# EasyEDA Pro project 电磁&运放一体板.epro

# Schematic 双电感A型
Board Name: Board1; Create Date: 2025-03-03; Page Name: P1; Project Name: 电磁&运放一体板（开发中）; Schematic Name: Schematic1; Update Date: 2025-03-07; Company: 嘉立创EDA; Page Size: A4; Version: V1.0
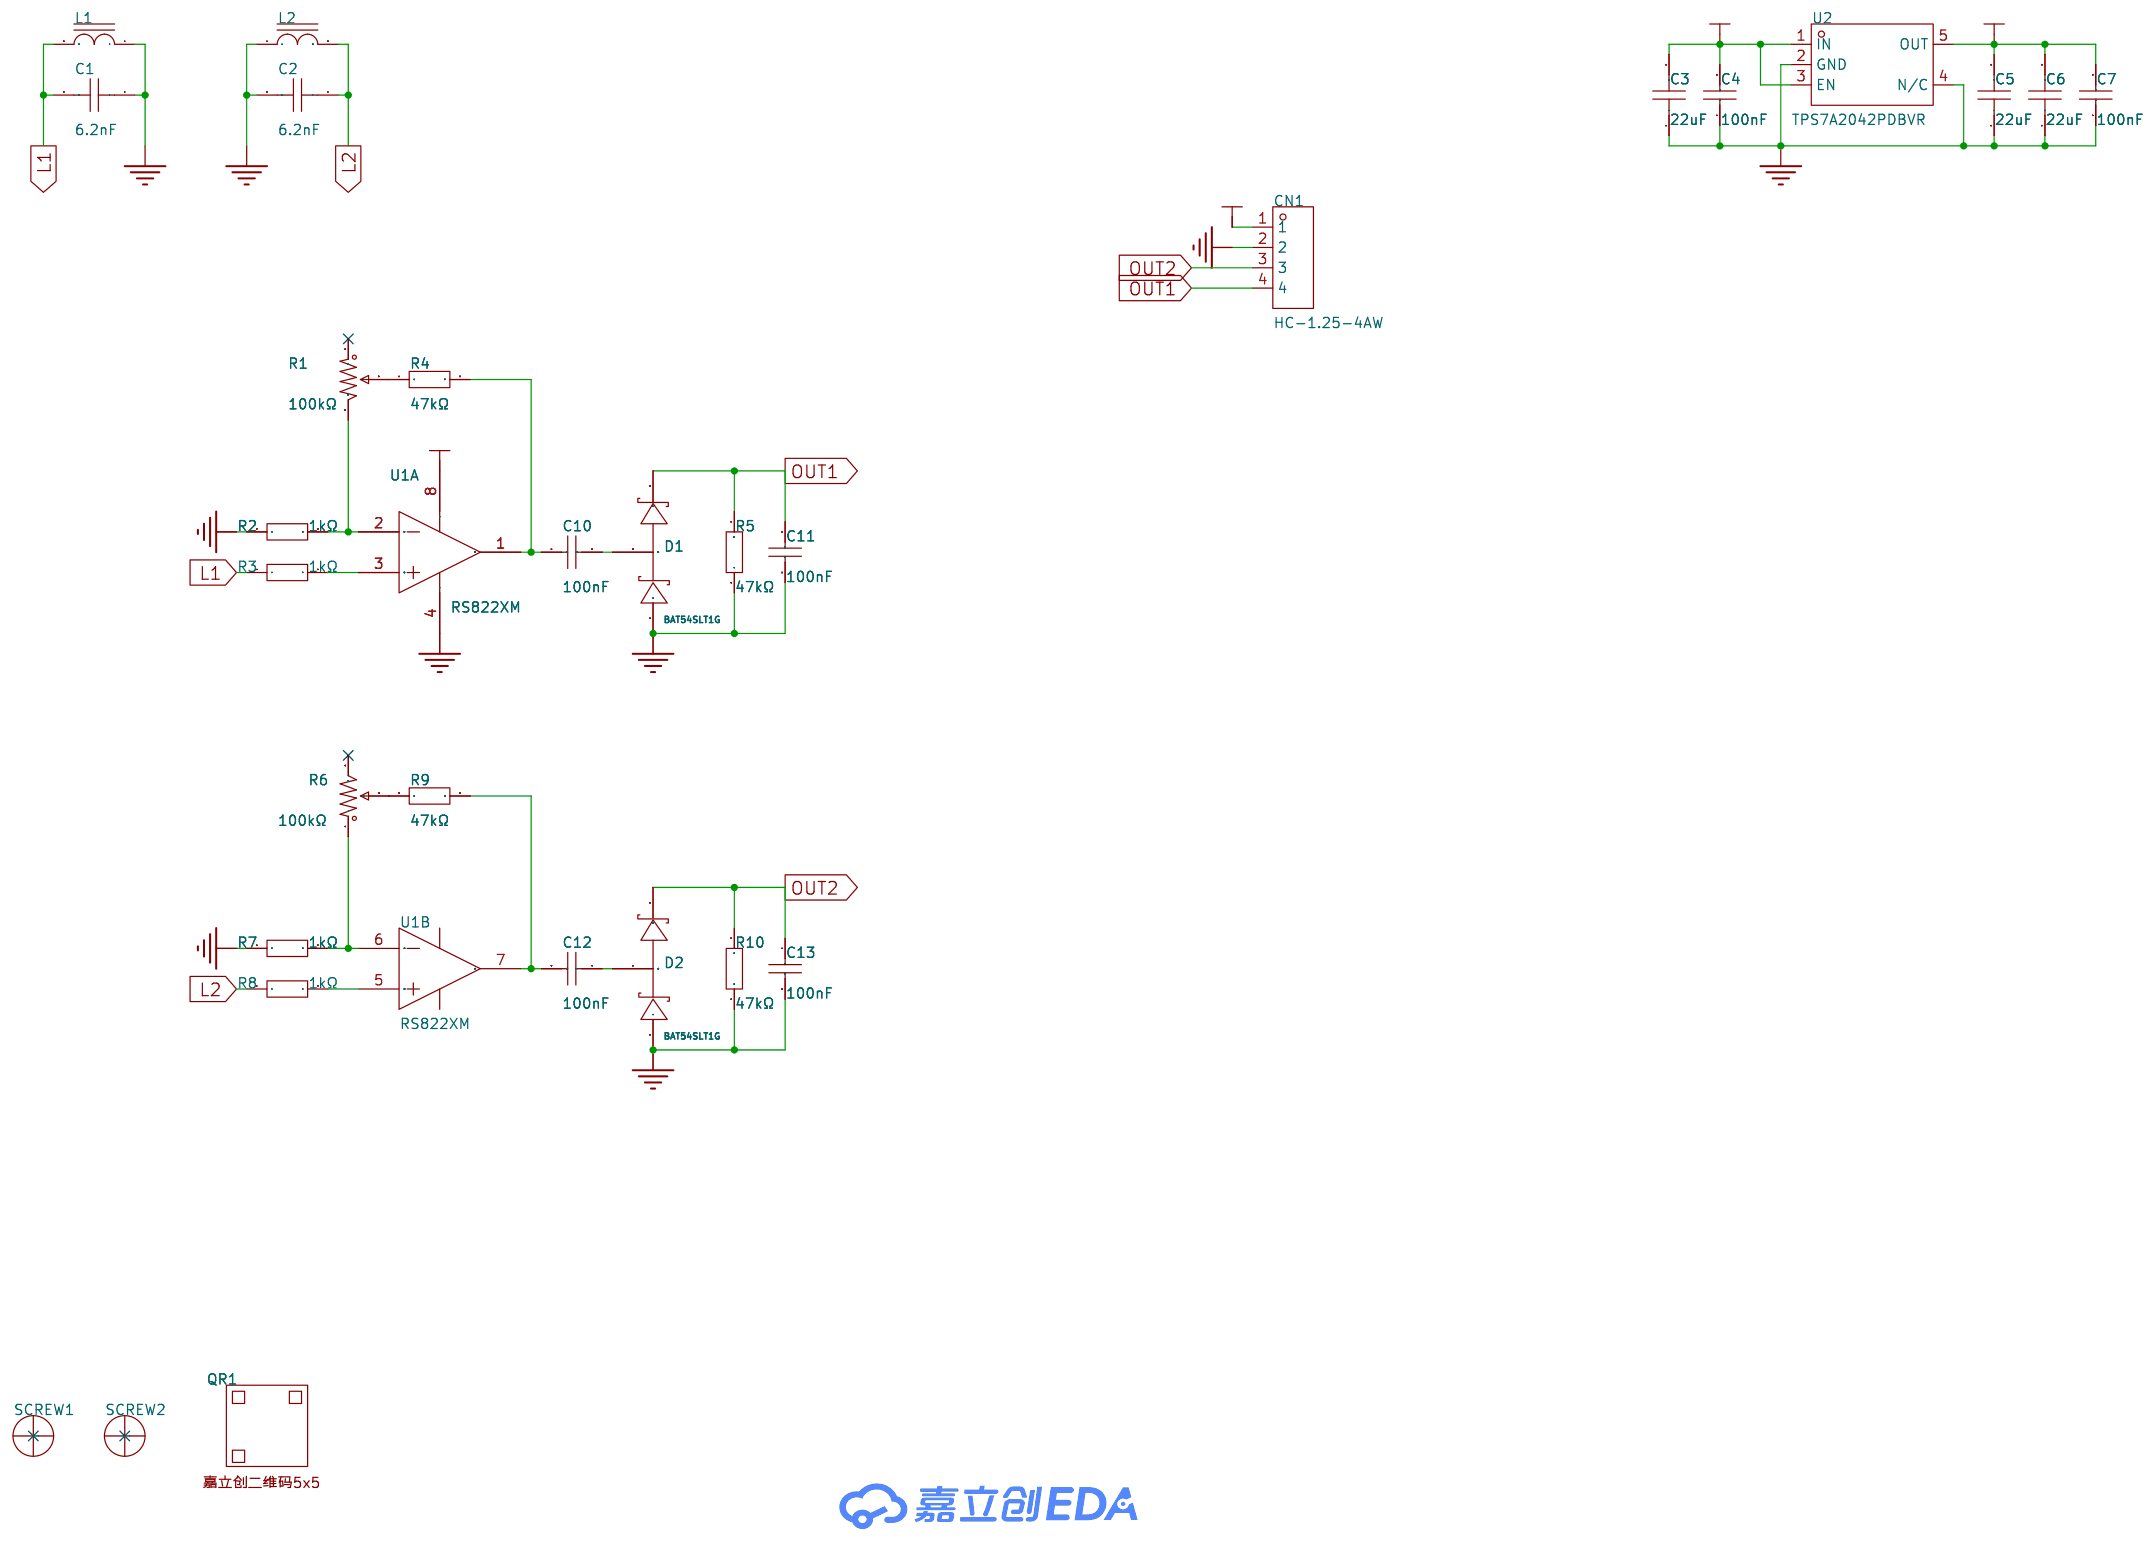
[diagram p0: schematic sheet]

## Parts
C1  6.2nF  [C0805]
C2  6.2nF  [C0805]
C3  22uF  [C0603]
C4  100nF  [C0603]
C5  22uF  [C0603]
C6  22uF  [C0603]
C7  100nF  [C0603]
C10  100nF  [C0603]
C11  100nF  [C0603]
C12  100nF  [C0603]
C13  100nF  [C0603]
CN1  HC-1.25-4AW  [CONN-TH_4P-P1.25_HCTL_HC-1.25-4AW]
D1  BAT54SLT1G  [SOT-23_L2.9-W1.3-P1.90-LS2.4-BR]
D2  BAT54SLT1G  [SOT-23_L2.9-W1.3-P1.90-LS2.4-BR]
L1  10mH  [INDUCTOR-H]
L2  10mH  [INDUCTOR-H]
QR1  -  [JLC-QRCODE-5x5]
R1  100kΩ  [RES-ADJ-SMD_TC33X-2-104E]
R2  1kΩ  [R0603]
R3  1kΩ  [R0603]
R4  47kΩ  [R0603]
R5  47kΩ  [R0603]
R6  100kΩ  [RES-ADJ-SMD_TC33X-2-104E]
R7  1kΩ  [R0603]
R8  1kΩ  [R0603]
R9  47kΩ  [R0603]
R10  47kΩ  [R0603]
SCREW1  -  [M3螺丝]
SCREW2  -  [M3螺丝]
U1  RS822XM  [MSOP-8_L3.0-W3.0-P0.65-LS5.0-BL]  (sections 1,2)
U2  TPS7A2042PDBVR  [SOT-23-5_L2.9-W1.6-P0.95-LS2.8-BR]

## Library data of the parts
C1 C2 = GRM2195C1H622JA01D: 容值:6.2nF;精度:±5%;额定电压:50V;材质(温度系数):C0G;; LCSC Part Name: 6.2nF ±5% 50V; Supplier Part: C710949; Manufacturer: muRata(村田); Supplier Footprint: 0805; JLCPCB Part Class: 扩展库; Datasheet: https://atta.szlcsc.com/upload/public/pdf/source/20230811/F8774C130DFCC406BD92840CAD6CCE22.pdf; Supplier: LCSC; Tolerance: ±5%; Voltage Rated: 50V; Temperature Coefficient: C0G
C3 C5 C6 = CL10A226MQ8NRNC: 容值:22uF;精度:±20%;额定电压:6.3V;材质(温度系数):X5R;; LCSC Part Name: 22uF ±20% 6.3V; Supplier Part: C59461; Manufacturer: SAMSUNG(三星); Supplier Footprint: 0603; JLCPCB Part Class: Basic Part; Datasheet: https://atta.szlcsc.com/upload/public/pdf/source/20160218/1457707763339.pdf; Supplier: LCSC; Tolerance: ±20%; Voltage Rated: 6.3V; Temperature Coefficient: X5R
C4 C7 C10-C13 = CC0603KRX7R9BB104: 容值:100nF;精度:±10%;额定电压:50V;材质(温度系数):X7R;; LCSC Part Name: 100nF ±10% 50V; Supplier Part: C14663; Manufacturer: YAGEO(国巨); Supplier Footprint: 0603; JLCPCB Part Class: Basic Part; Datasheet: https://atta.szlcsc.com/upload/public/pdf/source/20180910/C282072_33301C7F631E79921B82A8DAC6BCC5B3.pdf; Supplier: LCSC; Tolerance: ±10%; Voltage Rated: 50V; Temperature Coefficient: X7R
CN1 = HC-1.25-4AW: 插针结构:1x4P;间距:1.25mm;安装方式:弯插;参考系列:PicoBlade(MX 1.25);总PIN数:4P;排数:1;每排PIN数:4;行距:-;额定电流:1A;触头材质:黄铜;触头镀层:锡;工作温度范围:-25℃~+85℃;; LCSC Part Name: 1x4P 间距:1.25mm 弯插 系列:PicoBlade(MX 1.25); Supplier Part: C2845537; Manufacturer: HCTL(华灿天禄); Supplier Footprint: 弯插,P=1.25mm; JLCPCB Part Class: 扩展库; Datasheet: https://atta.szlcsc.com/upload/public/pdf/source/20230707/04F6BEA69F699E7BB6558EF06AF1DC24.pdf; Supplier: LCSC; Pins Structure: 1x4P; Pitch: 1.25mm; Mounting Style: 弯插; Reference Series: PicoBlade(MX 1.25); Number of Pins: 4P; Number of Rows: 1; Number of PINs Per Row: 4; Current Rating (Max): 1A; Contact Material: 黄铜; Contact Plating: 锡; Operating Temperature Range: -25℃~+85℃; Rated Voltage (Max): 125V; Plastic Material: PA46; Flame Retardant Rating: UL94V-0; Z-Height of the Board: 3.2mm; X-Length of Bottom Edge on Board (Spacing Line): 6.75mm; Y-Width of Bottom Edge on Board: 4.7mm
D1 D2 = BAT54SLT1G: 二极管配置:1对串联式;正向压降(Vf):800mV@100mA;直流反向耐压(Vr):30V;平均整流电流(Io):200mA;; LCSC Part Name: 电压:30V 电流:200mA; Supplier Part: C19726; Manufacturer: onsemi(安森美); Supplier Footprint: SOT-23; JLCPCB Part Class: 扩展库; Datasheet: https://atta.szlcsc.com/upload/public/pdf/source/20140815/1457707218410.pdf; Supplier: LCSC; Diode Configuration: 1对串联式; Forward Voltage (Vf@If): 800mV@100mA; Reverse Voltage (Vr): 30V; Average Rectified Current (Io): 200mA; Reverse Leakage Current (Ir): 2uA@25V
L1 L2 = 工字电感: Published: 8-Jun-2000; Revision: July-2002: Re-released for DXP Platform.; Publisher: Altium Limited; DCR: .5m; Price(RMB): 0.000; Imax: 1A; Origin Footprint 2: CD31; Origin Footprint 3: CD32; Origin Footprint 4: CD42; Origin Footprint 5: CD43; Origin Footprint 6: CD52; Origin Footprint 7: CD53; Origin Footprint 8: CD54; Origin Footprint 9: CD73; Origin Footprint 10: CD75; Origin Footprint 11: CD104; Origin Footprint 12: CD105; Origin Footprint 13: CD106; Origin Footprint 14: 127 Shielded 12.5*12.5*7; Origin Footprint 15: 0630 TPC 7*7*3; Origin Footprint 16: 1050 TPC 10*10*5; Origin Footprint 17: 1265 TPC 12*12*6.5; Origin Footprint 18: CD104R; Origin Footprint 19: SLO2520; Origin Footprint 20: 1365 TPC 13*13*6.5; Origin Footprint 21: INDUCTOR; Origin Footprint 22: 0402 TPC 4*4*2
QR1 = 嘉立创二维码5x5
R1 R6 = TC33X-2-104E: 阻值:100kΩ;精度:±25%;功率:150mW;温度系数:±250ppm/℃;; LCSC Part Name: 100kΩ ±25%; Supplier Part: C719186; Manufacturer: BOURNS; Supplier Footprint: SMD-3P,3.8x3.6mm; Datasheet: https://atta.szlcsc.com/upload/public/pdf/source/20200810/C720646_BB66A75E654D5E1D30127FF45BCD3C26.pdf; Supplier: LCSC; Tolerance: ±25%; Power(Watts): 150mW; Temperature Coefficient: ±250ppm/℃; Turns: 1
R2 R3 R7 R8 = RC0603FR-071KL: 电阻类型:厚膜电阻;阻值:1kΩ;精度:±1%;功率:100mW;最大工作电压:75V;温度系数:±100ppm/℃;; LCSC Part Name: 厚膜电阻 1kΩ ±1% 100mW; Supplier Part: C22548; Manufacturer: YAGEO(国巨); Supplier Footprint: 0603; JLCPCB Part Class: Extended Part; Datasheet: https://atta.szlcsc.com/upload/public/pdf/source/20180316/70C0E2BDAE7FCC62C531A5A58D202EE1.pdf; Supplier: LCSC; Type: 厚膜电阻; Tolerance: ±1%; Power(Watts): 100mW; Overload Voltage (Max): 75V; Temperature Coefficient: ±100ppm/℃; Operating Temperature Range: -55℃~+155℃
R4 R5 R9 R10 = RC0603FR-0747KL: 电阻类型:厚膜电阻;阻值:47kΩ;精度:±1%;功率:100mW;最大工作电压:75V;温度系数:±100ppm/℃;; LCSC Part Name: 厚膜电阻 47kΩ ±1% 100mW; Supplier Part: C105579; Manufacturer: YAGEO(国巨); Supplier Footprint: 0603; JLCPCB Part Class: Extended Part; Datasheet: https://atta.szlcsc.com/upload/public/pdf/source/20180316/70C0E2BDAE7FCC62C531A5A58D202EE1.pdf; Supplier: LCSC; Type: 厚膜电阻; Tolerance: ±1%; Power(Watts): 100mW; Overload Voltage (Max): 75V; Temperature Coefficient: ±100ppm/℃; Operating Temperature Range: -55℃~+155℃
SCREW1 SCREW2 = M3螺丝
U1 = RS822XM: 放大器数:双路;轨到轨:轨到轨输入,轨到轨输出;增益带宽积(GBP):14MHz;输入失调电压(Vos):2.5mV;压摆率(SR):10V/us;; LCSC Part Name: 低噪声运放RS822XM; Supplier Part: C255442; Manufacturer: RUNIC(润石); Supplier Footprint: MSOP-8; JLCPCB Part Class: 扩展库; Datasheet: https://atta.szlcsc.com/upload/public/pdf/source/20180801/C255445_305A33E98EF65BC5D144120E205E7EFA.pdf; Supplier: LCSC; Number of Circuits: 双路; Maximum Power Supply Range (Vdd-Vss): 5.5V; Rail to Rail: 轨到轨输入,轨到轨输出; Gain Bandwidth Product(GBP): 14MHz; Voltage - Input Offset(Vos): 2.5mV; Input Offset Voltage Drift (Vos TC): 1.6uV/℃; Slew Rate(SR): 10V/us; Noise density(eN): 5.5nV/√Hz@10kHz; Common Mode Rejection Ratio (CMRR): 75dB; Operating Temperature: -40℃~+125℃
U2 = TPS7A2042PDBVR: 输出类型:固定;最大输入电压:6V;输出电压:4.2V;输出电流:300mA;输出极性:正极;; LCSC Part Name: 具有高 PSRR 的 300mA、超低噪声、低 IQ、低压降 (LDO) 线性稳压器; Supplier Part: C2877861; Manufacturer: TI(德州仪器); Supplier Footprint: SOT-23-5; JLCPCB Part Class: 扩展库; Datasheet: https://www.ti.com/cn/lit/gpn/tps7a20; Supplier: LCSC; Output Type: 固定; Maximum Input Voltage: 6V; Output Voltage: 4.2V; Output Current: 300mA; Dropout Voltage: 145mV@(300mA); standby current: 15uA; Feature: 防静电保护；软启动；浪涌保护；低ESR；热保护(TSD)；欠压闭锁；过流保护(OCP)；带使能；防倒灌; Operating Temperature: -40℃~+125℃@(Tj); Output Polarity: 正极; Number of Outputs: 1

## Nets
4V2: C5.2 C6.2 C7.2 U1.8(V+) U2.5(OUT)
+5V: C3.2 C4.2 CN1.1 U2.1(IN) U2.3(EN)
GND: C1.1 C2.2 C3.1 C4.1 C5.1 C6.1 C7.1 C11.2 C13.2 CN1.2 D1.1(A) D2.1(A) L1.1 L2.1 R2.1 R5.1 R7.1 R10.1 U1.4(V-) U2.2(GND) U2.4(N/C)
L1: C1.2 L1.2 R3.1
L2: C2.1 L2.2 R8.1
OUT1: C11.1 CN1.4 D1.2(C) R5.2
OUT2: C13.1 CN1.3 D2.2(C) R10.2
$1N2795: R1.3 R2.2 U1.2(-INA)
$1N2799: R3.2 U1.3(+INA)
$1N2904: R1.2 R4.1
$1N2908: C10.2 R4.2 U1.1(OUTA)
$1N3029: C10.1 D1.3(A/C)
$1N3708: R6.1 R7.2 U1.6(-INB)
$1N3712: R8.2 U1.5(+INB)
$1N3714: R6.2 R9.1
$1N3716: C12.2 R9.2 U1.7(OUTB)
$1N3721: C12.1 D2.3(A/C)

Not connected (* = marked no-connect by the designer): R1 1*; R6 3*; SCREW1 1*; SCREW2 1*

# Schematic 双电感A型V2
Board Name: 双电感A型V2; Create Date: 2025-03-24; Page Name: P1; Project Name: （调试中）电磁&运放一体板; Schematic Name: 双电感A型V2; Update Date: 2025-03-25; Company: 嘉立创EDA; Page Size: A4; Version: V1.0
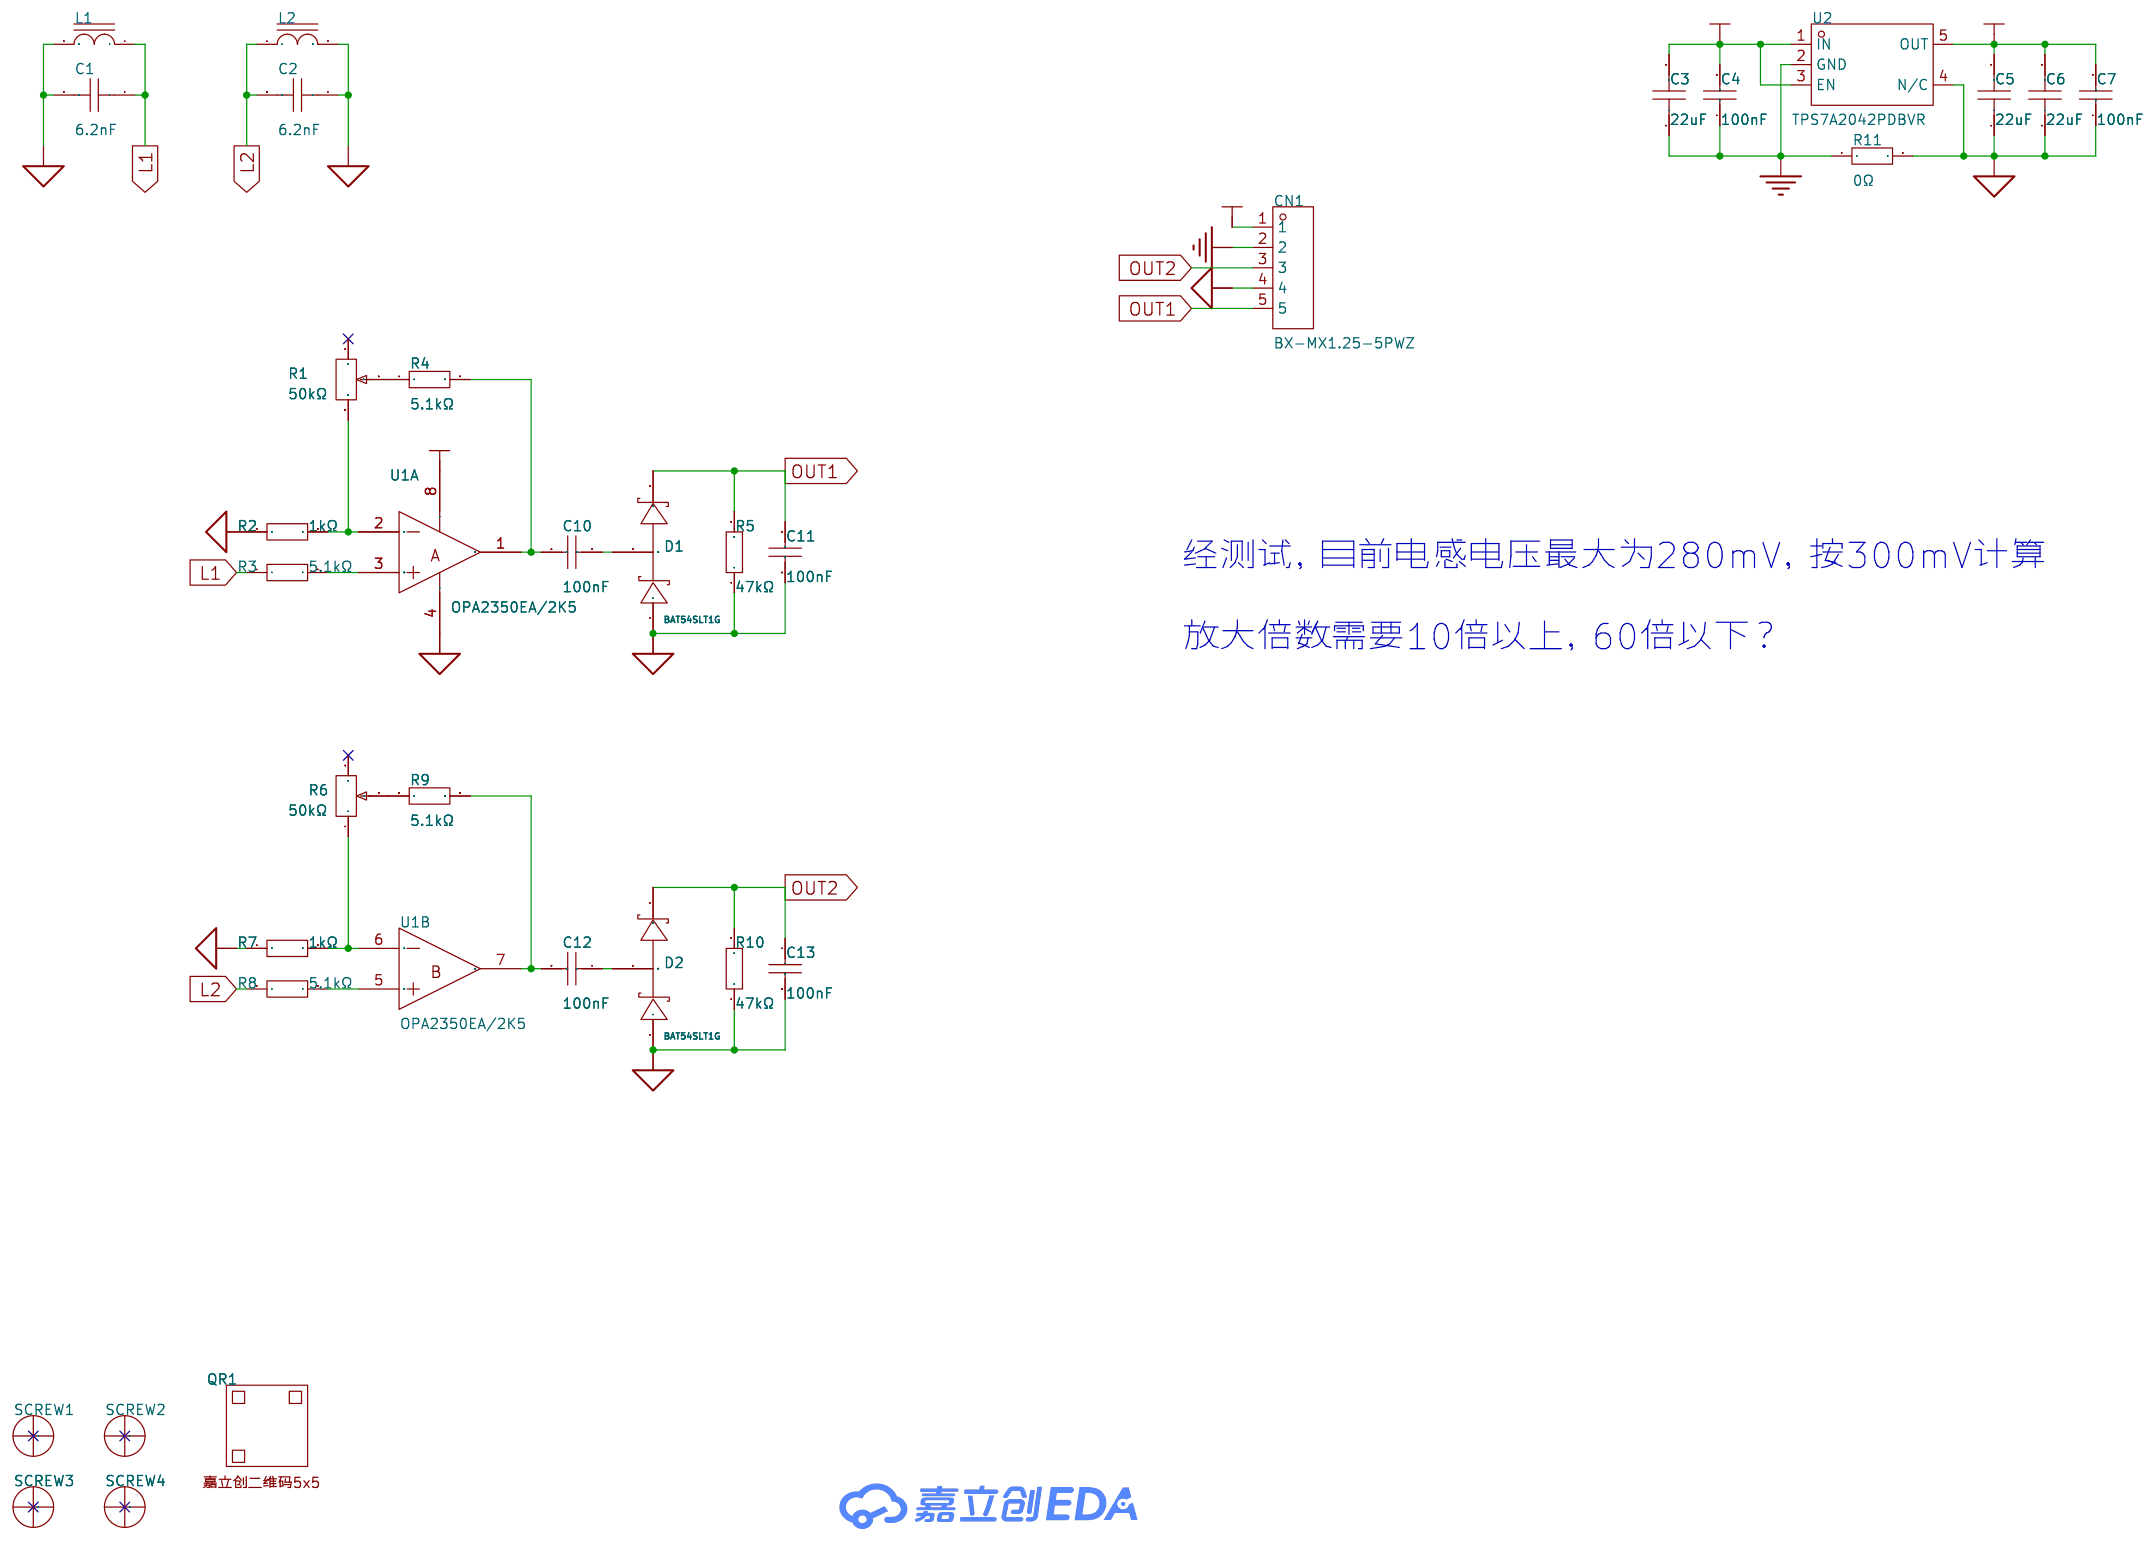
[diagram p1: schematic sheet]

## Parts
C1  6.2nF  [C0805]
C2  6.2nF  [C0805]
C3  22uF  [C0603]
C4  100nF  [C0603]
C5  22uF  [C0603]
C6  22uF  [C0603]
C7  100nF  [C0603]
C10  100nF  [C0603]
C11  100nF  [C0603]
C12  100nF  [C0603]
C13  100nF  [C0603]
CN1  BX-MX1.25-5PWZ  [CONN-TH_5P-P1.25_BX-MX1.25-5PWZ]
D1  BAT54SLT1G  [SOT-23_L2.9-W1.3-P1.90-LS2.4-BR]
D2  BAT54SLT1G  [SOT-23_L2.9-W1.3-P1.90-LS2.4-BR]
L1  10mH  [INDUCTOR-H]
L2  10mH  [INDUCTOR-H]
QR1  -  [JLC-QRCODE-5x5]
R1  50kΩ  [RES-ADJ-SMD_3224W]
R2  1kΩ  [R0603]
R3  5.1kΩ  [R0603]
R4  5.1kΩ  [R0603]
R5  47kΩ  [R0603]
R6  50kΩ  [RES-ADJ-SMD_3224W]
R7  1kΩ  [R0603]
R8  5.1kΩ  [R0603]
R9  5.1kΩ  [R0603]
R10  47kΩ  [R0603]
R11  0Ω  [R0805]
SCREW1  -  [M3螺丝]
SCREW2  -  [M3螺丝]
SCREW3  -  [M3螺丝]
SCREW4  -  [M3螺丝]
U1  OPA2350EA/2K5  [VSSOP-8_L3.0-W3.0-P0.65-LS5.0-BL]  (sections 1,2)
U2  TPS7A2042PDBVR  [SOT-23-5_L2.9-W1.6-P0.95-LS2.8-BR]

## Library data of the parts
C1 C2 = GRM2195C1H622JA01D: 容值:6.2nF;精度:±5%;额定电压:50V;材质(温度系数):C0G;; LCSC Part Name: 6.2nF ±5% 50V; Supplier Part: C710949; Manufacturer: muRata(村田); Supplier Footprint: 0805; JLCPCB Part Class: 扩展库; Datasheet: https://atta.szlcsc.com/upload/public/pdf/source/20230811/F8774C130DFCC406BD92840CAD6CCE22.pdf; Supplier: LCSC; Tolerance: ±5%; Voltage Rated: 50V; Temperature Coefficient: C0G
C3 C5 C6 = CL10A226MQ8NRNC: 容值:22uF;精度:±20%;额定电压:6.3V;材质(温度系数):X5R;; LCSC Part Name: 22uF ±20% 6.3V; Supplier Part: C59461; Manufacturer: SAMSUNG(三星); Supplier Footprint: 0603; JLCPCB Part Class: Basic Part; Datasheet: https://atta.szlcsc.com/upload/public/pdf/source/20160218/1457707763339.pdf; Supplier: LCSC; Tolerance: ±20%; Voltage Rated: 6.3V; Temperature Coefficient: X5R
C4 C7 C10-C13 = CC0603KRX7R9BB104: 容值:100nF;精度:±10%;额定电压:50V;材质(温度系数):X7R;; LCSC Part Name: 100nF ±10% 50V; Supplier Part: C14663; Manufacturer: YAGEO(国巨); Supplier Footprint: 0603; JLCPCB Part Class: Basic Part; Datasheet: https://atta.szlcsc.com/upload/public/pdf/source/20180910/C282072_33301C7F631E79921B82A8DAC6BCC5B3.pdf; Supplier: LCSC; Tolerance: ±10%; Voltage Rated: 50V; Temperature Coefficient: X7R
CN1 = BX-MX1.25-5PWZ: 插针结构:1x5P;间距:1.25mm;安装方式:弯插;参考系列:PicoBlade(MX 1.25);总PIN数:5P;排数:1;每排PIN数:5;行距:-;额定电流:1A;触头材质:黄铜;触头镀层:锡;工作温度:-25℃~+85℃;; LCSC Part Name: 1x5P 间距:1.25mm 弯插 系列:PicoBlade(MX 1.25); Supplier Part: C18077930; Manufacturer: Bossie(博锡); Supplier Footprint: 弯插,P=1.25mm; Datasheet: https://atta.szlcsc.com/upload/public/pdf/source/20231017/B7120ECF0A2D0178FB1687BFB19F48BC.pdf; Supplier: LCSC; Pins Structure: 1x5P; Pitch: 1.25mm; Mounting Type: 弯插; Reference Series: PicoBlade(MX 1.25); Number of Pins: 5P; Number of Rows: 1; Number of PINs Per Row: 5; Current Rating: 1A; Contact Material: 黄铜; Contact Plating: 锡; Operating Temperature: -25℃~+85℃; Voltage Rating: 125V; Plastic Material: PA; Color: 白色; Z-Height of the Board: 3.3mm; X-Length of Bottom Edge on Board (Spacing Line): 8.15mm; Y-Width of Bottom Edge on Board: 4.6mm
D1 D2 = BAT54SLT1G: 二极管配置:1对串联式;正向压降(Vf):800mV@100mA;直流反向耐压(Vr):30V;平均整流电流(Io):200mA;; LCSC Part Name: 电压:30V 电流:200mA; Supplier Part: C19726; Manufacturer: onsemi(安森美); Supplier Footprint: SOT-23; JLCPCB Part Class: 扩展库; Datasheet: https://atta.szlcsc.com/upload/public/pdf/source/20140815/1457707218410.pdf; Supplier: LCSC; Diode Configuration: 1对串联式; Forward Voltage (Vf@If): 800mV@100mA; Reverse Voltage (Vr): 30V; Average Rectified Current (Io): 200mA; Reverse Leakage Current (Ir): 2uA@25V
L1 L2 = 工字电感: Published: 8-Jun-2000; Revision: July-2002: Re-released for DXP Platform.; Publisher: Altium Limited; DCR: .5m; Price(RMB): 0.000; Imax: 1A; Origin Footprint 2: CD31; Origin Footprint 3: CD32; Origin Footprint 4: CD42; Origin Footprint 5: CD43; Origin Footprint 6: CD52; Origin Footprint 7: CD53; Origin Footprint 8: CD54; Origin Footprint 9: CD73; Origin Footprint 10: CD75; Origin Footprint 11: CD104; Origin Footprint 12: CD105; Origin Footprint 13: CD106; Origin Footprint 14: 127 Shielded 12.5*12.5*7; Origin Footprint 15: 0630 TPC 7*7*3; Origin Footprint 16: 1050 TPC 10*10*5; Origin Footprint 17: 1265 TPC 12*12*6.5; Origin Footprint 18: CD104R; Origin Footprint 19: SLO2520; Origin Footprint 20: 1365 TPC 13*13*6.5; Origin Footprint 21: INDUCTOR; Origin Footprint 22: 0402 TPC 4*4*2; Check: false
QR1 = 嘉立创二维码5x5: Check: false
R1 R6 = 3224W-1-503E: 阻值:50kΩ;精度:±10%;功率:250mW;温度系数:±100ppm/℃;; LCSC Part Name: 50kΩ ±10%; Supplier Part: C48484; Manufacturer: BOURNS; Supplier Footprint: SMD-3P,4.8x3.5mm; Datasheet: https://atta.szlcsc.com/upload/public/pdf/source/20160830/1472551532733.pdf; Supplier: LCSC; Tolerance: ±10%; Power(Watts): 250mW; Temperature Coefficient: ±100ppm/℃; Turns: 12
R2 R7 = RC0603FR-071KL: 电阻类型:厚膜电阻;阻值:1kΩ;精度:±1%;功率:100mW;最大工作电压:75V;温度系数:±100ppm/℃;; LCSC Part Name: 厚膜电阻 1kΩ ±1% 100mW; Supplier Part: C22548; Manufacturer: YAGEO(国巨); Supplier Footprint: 0603; JLCPCB Part Class: Extended Part; Datasheet: https://atta.szlcsc.com/upload/public/pdf/source/20180316/70C0E2BDAE7FCC62C531A5A58D202EE1.pdf; Supplier: LCSC; Type: 厚膜电阻; Tolerance: ±1%; Power(Watts): 100mW; Overload Voltage (Max): 75V; Temperature Coefficient: ±100ppm/℃; Operating Temperature Range: -55℃~+155℃
R3 R4 R8 R9 = RC0603FR-075K1L: 电阻类型:厚膜电阻;阻值:5.1kΩ;精度:±1%;功率:100mW;最大工作电压:75V;温度系数:±100ppm/℃;; LCSC Part Name: 厚膜电阻 5.1kΩ ±1% 100mW; Supplier Part: C105580; Manufacturer: YAGEO(国巨); Supplier Footprint: 0603; JLCPCB Part Class: Extended Part; Datasheet: https://atta.szlcsc.com/upload/public/pdf/source/20180316/70C0E2BDAE7FCC62C531A5A58D202EE1.pdf; Supplier: LCSC; Type: 厚膜电阻; Tolerance: ±1%; Power(Watts): 100mW; Overload Voltage (Max): 75V; Temperature Coefficient: ±100ppm/℃; Operating Temperature Range: -55℃~+155℃
R5 R10 = RC0603FR-0747KL: 电阻类型:厚膜电阻;阻值:47kΩ;精度:±1%;功率:100mW;最大工作电压:75V;温度系数:±100ppm/℃;; LCSC Part Name: 厚膜电阻 47kΩ ±1% 100mW; Supplier Part: C105579; Manufacturer: YAGEO(国巨); Supplier Footprint: 0603; JLCPCB Part Class: Extended Part; Datasheet: https://atta.szlcsc.com/upload/public/pdf/source/20180316/70C0E2BDAE7FCC62C531A5A58D202EE1.pdf; Supplier: LCSC; Type: 厚膜电阻; Tolerance: ±1%; Power(Watts): 100mW; Overload Voltage (Max): 75V; Temperature Coefficient: ±100ppm/℃; Operating Temperature Range: -55℃~+155℃
R11 = RC0805FR-070RL: 电阻类型:厚膜电阻;阻值:0Ω;精度:±1%;功率:125mW;最大工作电压:150V;温度系数:-;; LCSC Part Name: 厚膜电阻 0Ω ±1% 125mW; Supplier Part: C100045; Manufacturer: YAGEO(国巨); Supplier Footprint: 0805; Datasheet: https://atta.szlcsc.com/upload/public/pdf/source/20180904/C276339_014E484F1DBA106FB92D45EABD5A1AC1.pdf; Supplier: LCSC; Type: 厚膜电阻; Tolerance: ±1%; Power(Watts): 125mW; Overload Voltage (Max): 150V; Operating Temperature Range: -55℃~+155℃
SCREW1-SCREW4 = M3螺丝: Check: false
U1 = OPA2350EA/2K5: OPA2350 双通道单电源、轨至轨、高速、低噪声运算放大器; Supplier Part: C115876; Manufacturer: TI(德州仪器); Supplier Footprint: VSSOP-8; JLCPCB Part Class: Extended Part; Datasheet: https://www.ti.com/cn/lit/gpn/opa2350; Supplier: LCSC
U2 = TPS7A2042PDBVR: 输出类型:固定;最大输入电压:6V;输出电压:4.2V;输出电流:300mA;输出极性:正极;; LCSC Part Name: 具有高 PSRR 的 300mA、超低噪声、低 IQ、低压降 (LDO) 线性稳压器; Supplier Part: C2877861; Manufacturer: TI(德州仪器); Supplier Footprint: SOT-23-5; JLCPCB Part Class: 扩展库; Datasheet: https://www.ti.com/cn/lit/gpn/tps7a20; Supplier: LCSC; Output Type: 固定; Maximum Input Voltage: 6V; Output Voltage: 4.2V; Output Current: 300mA; Dropout Voltage: 145mV@(300mA); standby current: 15uA; Feature: 防静电保护；软启动；浪涌保护；低ESR；热保护(TSD)；欠压闭锁；过流保护(OCP)；带使能；防倒灌; Operating Temperature: -40℃~+125℃@(Tj); Output Polarity: 正极; Number of Outputs: 1

## Nets
4V2: C5.2 C6.2 C7.2 U1.8(V+) U2.5(OUT)
+5V: C3.2 C4.2 CN1.1 U2.1(IN) U2.3(EN)
AGND: C1.2 C2.1 C5.1 C6.1 C7.1 C11.2 C13.2 CN1.4 D1.1(A) D2.1(A) L1.2 L2.2 R2.1 R5.1 R7.1 R10.1 R11.2 U1.4(V-) U2.4(N/C)
GND: C3.1 C4.1 CN1.2 R11.1 U2.2(GND)
L1: C1.1 L1.1 R3.1
L2: C2.2 L2.1 R8.1
OUT1: C11.1 CN1.5 D1.2(C) R5.2
OUT2: C13.1 CN1.3 D2.2(C) R10.2
$1N2795: R1.3 R2.2 U1.2(INA-)
$1N2799: R3.2 U1.3(INA+)
$1N2908: C10.2 R4.2 U1.1(OUTA)
$1N3029: C10.1 D1.3(A/C)
$1N3708: R6.1 R7.2 U1.6(INB-)
$1N3712: R8.2 U1.5(INB+)
$1N3716: C12.2 R9.2 U1.7(OUTB)
$1N3721: C12.1 D2.3(A/C)
$1N7358: R1.2 R4.1
$1N7360: R6.2 R9.1

Not connected (* = marked no-connect by the designer): R1 1*; R6 3*; SCREW1 1*; SCREW2 1*; SCREW3 1*; SCREW4 1*

## Notes on the sheet
- 经测试，目前电感电压最大为280mV，按300mV计算
  放大倍数需要10倍以上，60倍以下？

# Schematic 双电感A型V2_1
Board Name: 双电感A型V2_1; Create Date: 2025-06-23; Page Name: P1; Project Name: （调试中）电磁&运放一体板; Schematic Name: 双电感A型V2_1; Update Date: 2025-06-23; Company: 嘉立创EDA; Page Size: A4; Version: V1.0
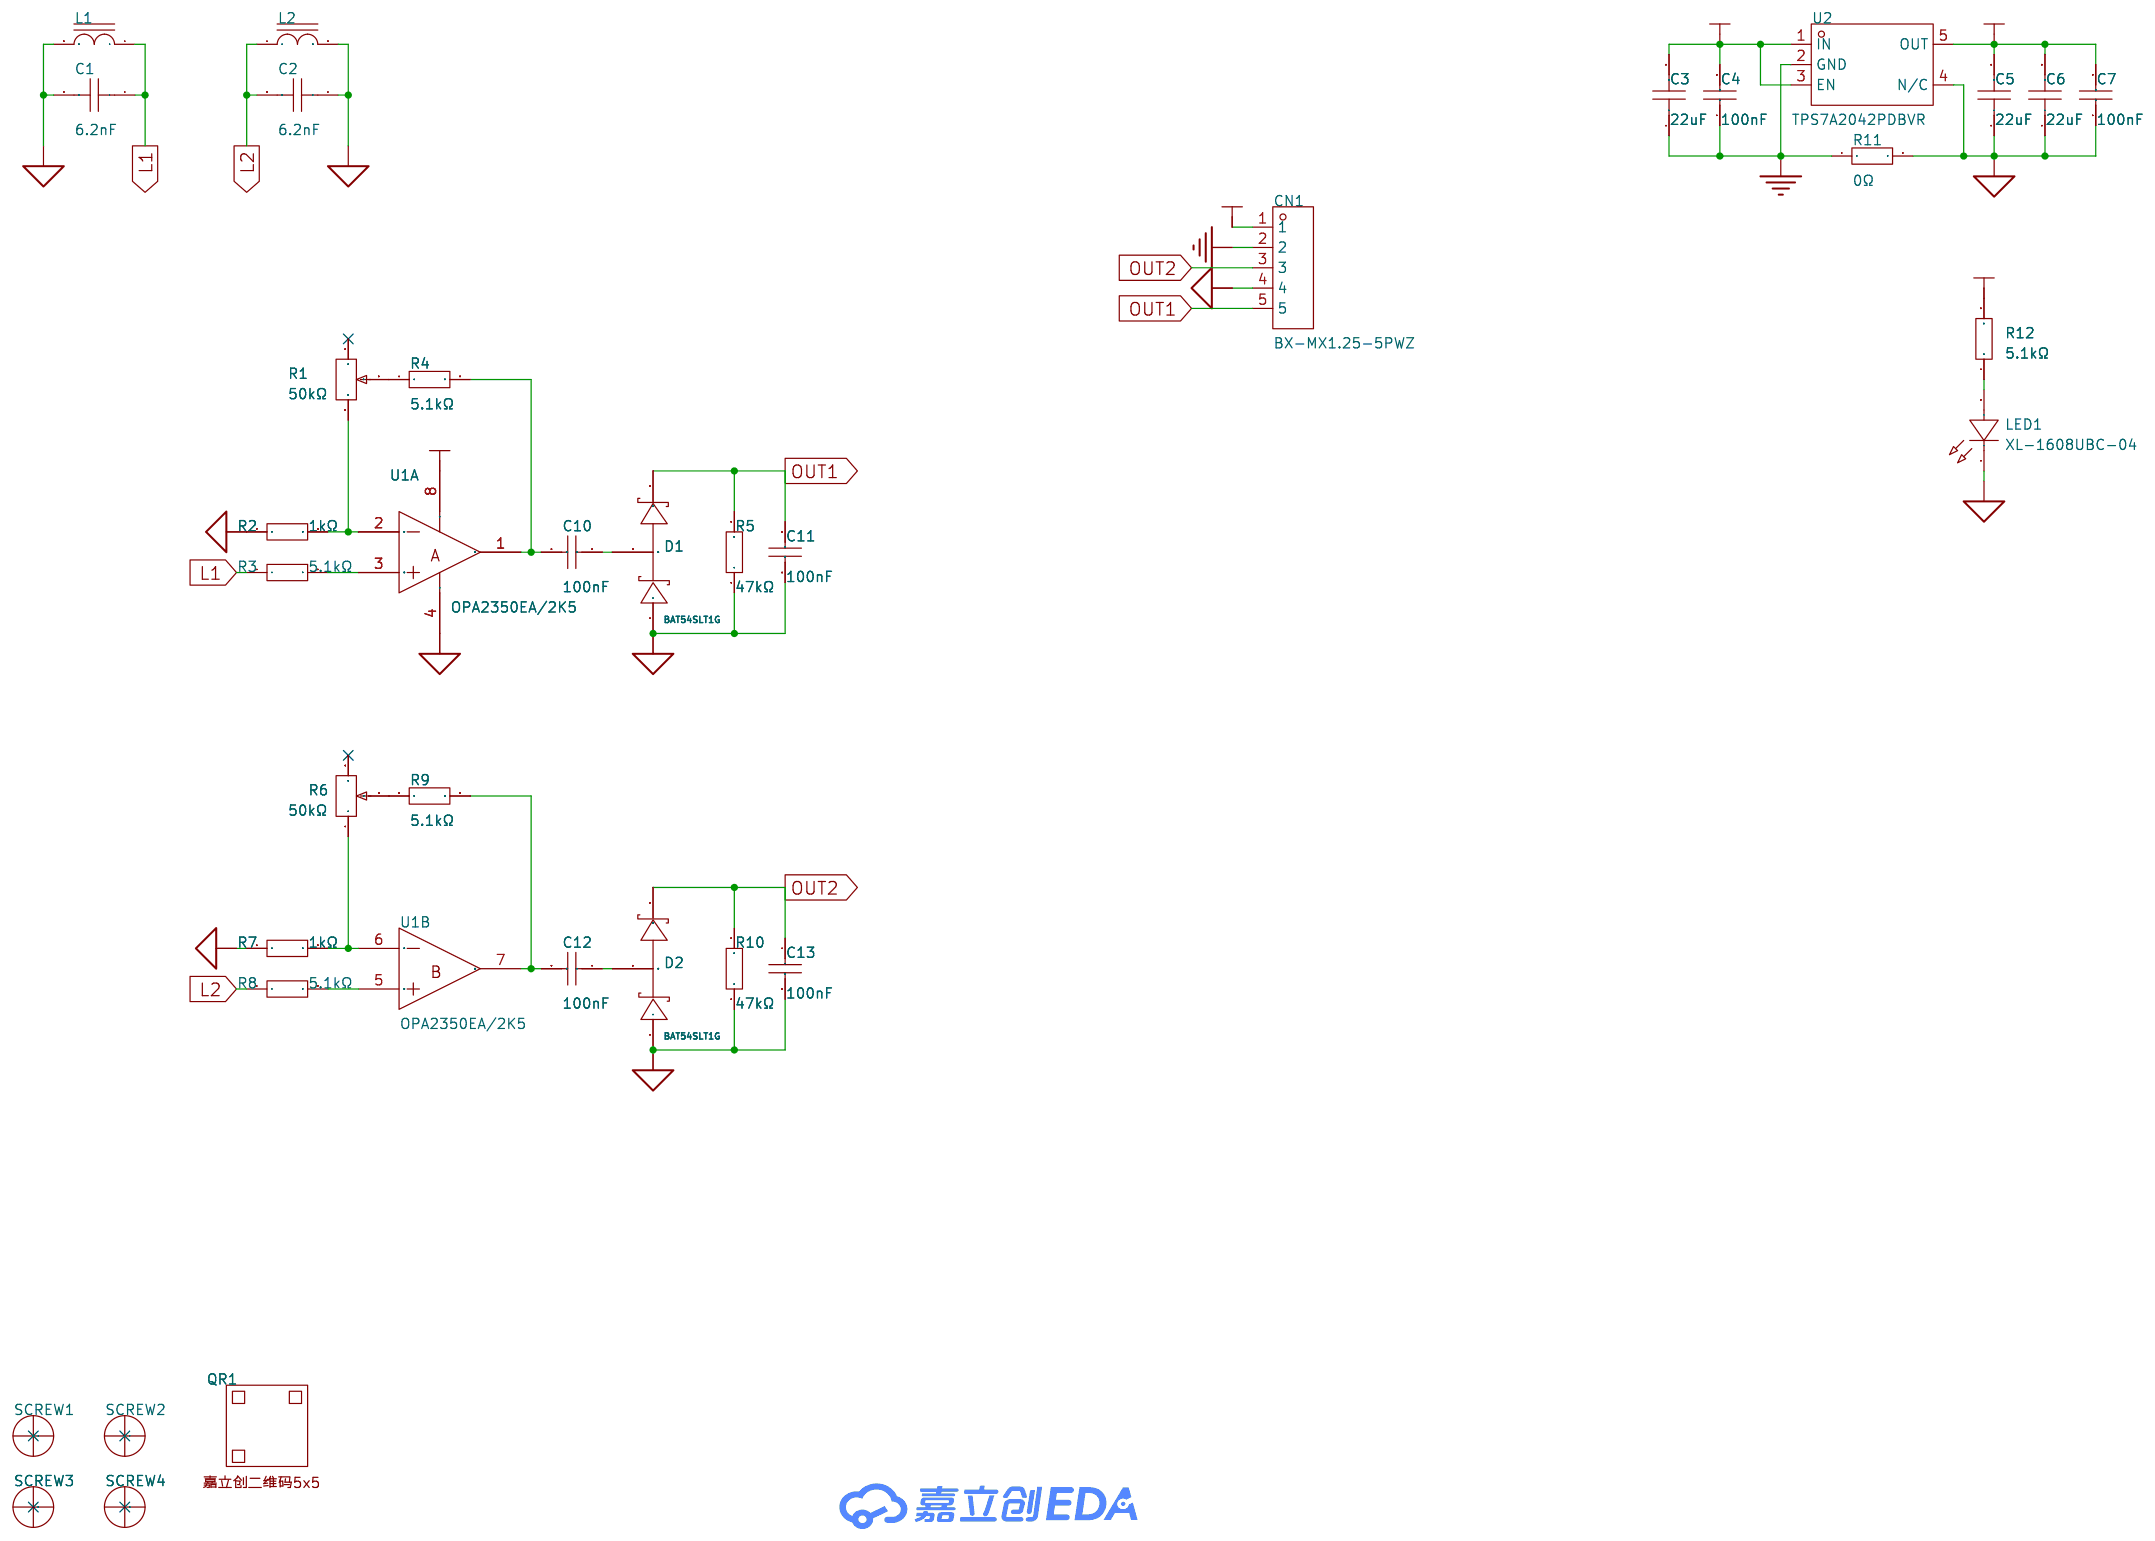
[diagram p2: schematic sheet]

## Parts
C1  6.2nF  [C0805]
C2  6.2nF  [C0805]
C3  22uF  [C0603]
C4  100nF  [C0603]
C5  22uF  [C0603]
C6  22uF  [C0603]
C7  100nF  [C0603]
C10  100nF  [C0603]
C11  100nF  [C0603]
C12  100nF  [C0603]
C13  100nF  [C0603]
CN1  BX-MX1.25-5PWZ  [CONN-TH_5P-P1.25_BX-MX1.25-5PWZ]
D1  BAT54SLT1G  [SOT-23_L2.9-W1.3-P1.90-LS2.4-BR]
D2  BAT54SLT1G  [SOT-23_L2.9-W1.3-P1.90-LS2.4-BR]
L1  10mH  [INDUCTOR-H]
L2  10mH  [INDUCTOR-H]
LED1  XL-1608UBC-04  [LED0603-RD_BLUE]
QR1  -  [JLC-QRCODE-5x5]
R1  50kΩ  [RES-ADJ-SMD_3224W]
R2  1kΩ  [R0603]
R3  5.1kΩ  [R0603]
R4  5.1kΩ  [R0603]
R5  47kΩ  [R0603]
R6  50kΩ  [RES-ADJ-SMD_3224W]
R7  1kΩ  [R0603]
R8  5.1kΩ  [R0603]
R9  5.1kΩ  [R0603]
R10  47kΩ  [R0603]
R11  0Ω  [R0805]
R12  5.1kΩ  [R0603]
SCREW1  -  [M3螺丝]
SCREW2  -  [M3螺丝]
SCREW3  -  [M3螺丝]
SCREW4  -  [M3螺丝]
U1  OPA2350EA/2K5  [VSSOP-8_L3.0-W3.0-P0.65-LS5.0-BL]  (sections 1,2)
U2  TPS7A2042PDBVR  [SOT-23-5_L2.9-W1.6-P0.95-LS2.8-BR]

## Library data of the parts
C1 C2 = GRM2195C1H622JA01D: 容值:6.2nF;精度:±5%;额定电压:50V;材质(温度系数):C0G;; LCSC Part Name: 6.2nF ±5% 50V; Supplier Part: C710949; Manufacturer: muRata(村田); Supplier Footprint: 0805; JLCPCB Part Class: 扩展库; Datasheet: https://atta.szlcsc.com/upload/public/pdf/source/20230811/F8774C130DFCC406BD92840CAD6CCE22.pdf; Supplier: LCSC; Tolerance: ±5%; Voltage Rated: 50V; Temperature Coefficient: C0G
C3 C5 C6 = CL10A226MQ8NRNC: 容值:22uF;精度:±20%;额定电压:6.3V;材质(温度系数):X5R;; LCSC Part Name: 22uF ±20% 6.3V; Supplier Part: C59461; Manufacturer: SAMSUNG(三星); Supplier Footprint: 0603; JLCPCB Part Class: Basic Part; Datasheet: https://atta.szlcsc.com/upload/public/pdf/source/20160218/1457707763339.pdf; Supplier: LCSC; Tolerance: ±20%; Voltage Rated: 6.3V; Temperature Coefficient: X5R
C4 C7 C10-C13 = CC0603KRX7R9BB104: 容值:100nF;精度:±10%;额定电压:50V;材质(温度系数):X7R;; LCSC Part Name: 100nF ±10% 50V; Supplier Part: C14663; Manufacturer: YAGEO(国巨); Supplier Footprint: 0603; JLCPCB Part Class: Basic Part; Datasheet: https://atta.szlcsc.com/upload/public/pdf/source/20180910/C282072_33301C7F631E79921B82A8DAC6BCC5B3.pdf; Supplier: LCSC; Tolerance: ±10%; Voltage Rated: 50V; Temperature Coefficient: X7R
CN1 = BX-MX1.25-5PWZ: 插针结构:1x5P;间距:1.25mm;安装方式:弯插;参考系列:PicoBlade(MX 1.25);总PIN数:5P;排数:1;每排PIN数:5;行距:-;额定电流:1A;触头材质:黄铜;触头镀层:锡;工作温度:-25℃~+85℃;; LCSC Part Name: 1x5P 间距:1.25mm 弯插 系列:PicoBlade(MX 1.25); Supplier Part: C18077930; Manufacturer: Bossie(博锡); Supplier Footprint: 弯插,P=1.25mm; Datasheet: https://atta.szlcsc.com/upload/public/pdf/source/20231017/B7120ECF0A2D0178FB1687BFB19F48BC.pdf; Supplier: LCSC; Pins Structure: 1x5P; Pitch: 1.25mm; Mounting Type: 弯插; Reference Series: PicoBlade(MX 1.25); Number of Pins: 5P; Number of Rows: 1; Number of PINs Per Row: 5; Current Rating: 1A; Contact Material: 黄铜; Contact Plating: 锡; Operating Temperature: -25℃~+85℃; Voltage Rating: 125V; Plastic Material: PA; Color: 白色; Z-Height of the Board: 3.3mm; X-Length of Bottom Edge on Board (Spacing Line): 8.15mm; Y-Width of Bottom Edge on Board: 4.6mm
D1 D2 = BAT54SLT1G: 二极管配置:1对串联式;正向压降(Vf):800mV@100mA;直流反向耐压(Vr):30V;平均整流电流(Io):200mA;; LCSC Part Name: 电压:30V 电流:200mA; Supplier Part: C19726; Manufacturer: onsemi(安森美); Supplier Footprint: SOT-23; JLCPCB Part Class: 扩展库; Datasheet: https://atta.szlcsc.com/upload/public/pdf/source/20140815/1457707218410.pdf; Supplier: LCSC; Diode Configuration: 1对串联式; Forward Voltage (Vf@If): 800mV@100mA; Reverse Voltage (Vr): 30V; Average Rectified Current (Io): 200mA; Reverse Leakage Current (Ir): 2uA@25V
L1 L2 = 工字电感: Published: 8-Jun-2000; Revision: July-2002: Re-released for DXP Platform.; Publisher: Altium Limited; DCR: .5m; Price(RMB): 0.000; Imax: 1A; Origin Footprint 2: CD31; Origin Footprint 3: CD32; Origin Footprint 4: CD42; Origin Footprint 5: CD43; Origin Footprint 6: CD52; Origin Footprint 7: CD53; Origin Footprint 8: CD54; Origin Footprint 9: CD73; Origin Footprint 10: CD75; Origin Footprint 11: CD104; Origin Footprint 12: CD105; Origin Footprint 13: CD106; Origin Footprint 14: 127 Shielded 12.5*12.5*7; Origin Footprint 15: 0630 TPC 7*7*3; Origin Footprint 16: 1050 TPC 10*10*5; Origin Footprint 17: 1265 TPC 12*12*6.5; Origin Footprint 18: CD104R; Origin Footprint 19: SLO2520; Origin Footprint 20: 1365 TPC 13*13*6.5; Origin Footprint 21: INDUCTOR; Origin Footprint 22: 0402 TPC 4*4*2; Check: false
LED1 = XL-1608UBC-04: 灯头类型:-;发光颜色:蓝色;正向压降(Vf):3.3V;功率:70mW;正向电流:20mA;波长:455nm~475nm;二极管配置:-;透镜颜色:无色透明透镜;色温:-;发光强度:300mcd;发光角度:120°;载带方式:正贴;工作温度:-20℃~+85℃;; Supplier Part: C965807; Manufacturer: XINGLIGHT(成兴光); Supplier Footprint: 0603; JLCPCB Part Class: 扩展库; Datasheet: https://atta.szlcsc.com/upload/public/pdf/source/20250213/9D28F40E58C3285D8CA3C7212E2FBA3B.pdf; Supplier: LCSC; Illumination Color: 蓝色; Voltage - Forward(Vf): 3.3V; Power(Watts): 70mW; Forward Current: 20mA; Wavelength - Dominant: 455nm~475nm; Peak Wavelength: 470nm; Lens Color: 无色透明透镜; Luminous Intensity: 300mcd; Viewing Angle: 120°; Mounting Sytle: 正贴; Operating Temperature: -20℃~+85℃
QR1 = 嘉立创二维码5x5: Check: false
R1 R6 = 3224W-1-503E: 阻值:50kΩ;精度:±10%;功率:250mW;温度系数:±100ppm/℃;; LCSC Part Name: 50kΩ ±10%; Supplier Part: C48484; Manufacturer: BOURNS; Supplier Footprint: SMD-3P,4.8x3.5mm; Datasheet: https://atta.szlcsc.com/upload/public/pdf/source/20160830/1472551532733.pdf; Supplier: LCSC; Tolerance: ±10%; Power(Watts): 250mW; Temperature Coefficient: ±100ppm/℃; Turns: 12
R2 R7 = RC0603FR-071KL: 电阻类型:厚膜电阻;阻值:1kΩ;精度:±1%;功率:100mW;最大工作电压:75V;温度系数:±100ppm/℃;; LCSC Part Name: 厚膜电阻 1kΩ ±1% 100mW; Supplier Part: C22548; Manufacturer: YAGEO(国巨); Supplier Footprint: 0603; JLCPCB Part Class: Extended Part; Datasheet: https://atta.szlcsc.com/upload/public/pdf/source/20180316/70C0E2BDAE7FCC62C531A5A58D202EE1.pdf; Supplier: LCSC; Type: 厚膜电阻; Tolerance: ±1%; Power(Watts): 100mW; Overload Voltage (Max): 75V; Temperature Coefficient: ±100ppm/℃; Operating Temperature Range: -55℃~+155℃
R3 R4 R8 R9 R12 = RC0603FR-075K1L: 电阻类型:厚膜电阻;阻值:5.1kΩ;精度:±1%;功率:100mW;最大工作电压:75V;温度系数:±100ppm/℃;; LCSC Part Name: 厚膜电阻 5.1kΩ ±1% 100mW; Supplier Part: C105580; Manufacturer: YAGEO(国巨); Supplier Footprint: 0603; JLCPCB Part Class: Extended Part; Datasheet: https://atta.szlcsc.com/upload/public/pdf/source/20180316/70C0E2BDAE7FCC62C531A5A58D202EE1.pdf; Supplier: LCSC; Type: 厚膜电阻; Tolerance: ±1%; Power(Watts): 100mW; Overload Voltage (Max): 75V; Temperature Coefficient: ±100ppm/℃; Operating Temperature Range: -55℃~+155℃
R5 R10 = RC0603FR-0747KL: 电阻类型:厚膜电阻;阻值:47kΩ;精度:±1%;功率:100mW;最大工作电压:75V;温度系数:±100ppm/℃;; LCSC Part Name: 厚膜电阻 47kΩ ±1% 100mW; Supplier Part: C105579; Manufacturer: YAGEO(国巨); Supplier Footprint: 0603; JLCPCB Part Class: Extended Part; Datasheet: https://atta.szlcsc.com/upload/public/pdf/source/20180316/70C0E2BDAE7FCC62C531A5A58D202EE1.pdf; Supplier: LCSC; Type: 厚膜电阻; Tolerance: ±1%; Power(Watts): 100mW; Overload Voltage (Max): 75V; Temperature Coefficient: ±100ppm/℃; Operating Temperature Range: -55℃~+155℃
R11 = RC0805FR-070RL: 电阻类型:厚膜电阻;阻值:0Ω;精度:±1%;功率:125mW;最大工作电压:150V;温度系数:-;; LCSC Part Name: 厚膜电阻 0Ω ±1% 125mW; Supplier Part: C100045; Manufacturer: YAGEO(国巨); Supplier Footprint: 0805; Datasheet: https://atta.szlcsc.com/upload/public/pdf/source/20180904/C276339_014E484F1DBA106FB92D45EABD5A1AC1.pdf; Supplier: LCSC; Type: 厚膜电阻; Tolerance: ±1%; Power(Watts): 125mW; Overload Voltage (Max): 150V; Operating Temperature Range: -55℃~+155℃
SCREW1-SCREW4 = M3螺丝: Check: false
U1 = OPA2350EA/2K5: OPA2350 双通道单电源、轨至轨、高速、低噪声运算放大器; Supplier Part: C115876; Manufacturer: TI(德州仪器); Supplier Footprint: VSSOP-8; JLCPCB Part Class: Extended Part; Datasheet: https://www.ti.com/cn/lit/gpn/opa2350; Supplier: LCSC
U2 = TPS7A2042PDBVR: 输出类型:固定;最大输入电压:6V;输出电压:4.2V;输出电流:300mA;输出极性:正极;; LCSC Part Name: 具有高 PSRR 的 300mA、超低噪声、低 IQ、低压降 (LDO) 线性稳压器; Supplier Part: C2877861; Manufacturer: TI(德州仪器); Supplier Footprint: SOT-23-5; JLCPCB Part Class: 扩展库; Datasheet: https://www.ti.com/cn/lit/gpn/tps7a20; Supplier: LCSC; Output Type: 固定; Maximum Input Voltage: 6V; Output Voltage: 4.2V; Output Current: 300mA; Dropout Voltage: 145mV@(300mA); standby current: 15uA; Feature: 防静电保护；软启动；浪涌保护；低ESR；热保护(TSD)；欠压闭锁；过流保护(OCP)；带使能；防倒灌; Operating Temperature: -40℃~+125℃@(Tj); Output Polarity: 正极; Number of Outputs: 1

## Nets
4V2: C5.2 C6.2 C7.2 R12.2 U1.8(V+) U2.5(OUT)
+5V: C3.2 C4.2 CN1.1 U2.1(IN) U2.3(EN)
AGND: C1.2 C2.1 C5.1 C6.1 C7.1 C11.2 C13.2 CN1.4 D1.1(A) D2.1(A) L1.2 L2.2 LED1.1(K) R2.1 R5.1 R7.1 R10.1 R11.2 U1.4(V-) U2.4(N/C)
GND: C3.1 C4.1 CN1.2 R11.1 U2.2(GND)
L1: C1.1 L1.1 R3.1
L2: C2.2 L2.1 R8.1
OUT1: C11.1 CN1.5 D1.2(C) R5.2
OUT2: C13.1 CN1.3 D2.2(C) R10.2
$1N2795: R1.3 R2.2 U1.2(INA-)
$1N2799: R3.2 U1.3(INA+)
$1N2908: C10.2 R4.2 U1.1(OUTA)
$1N3029: C10.1 D1.3(A/C)
$1N3708: R6.1 R7.2 U1.6(INB-)
$1N3712: R8.2 U1.5(INB+)
$1N3716: C12.2 R9.2 U1.7(OUTB)
$1N3721: C12.1 D2.3(A/C)
$1N7358: R1.2 R4.1
$1N7360: R6.2 R9.1
$1N13241: LED1.2(A) R12.1

Not connected (* = marked no-connect by the designer): R1 1*; R6 3*; SCREW1 1*; SCREW2 1*; SCREW3 1*; SCREW4 1*

# Board 双电感A型
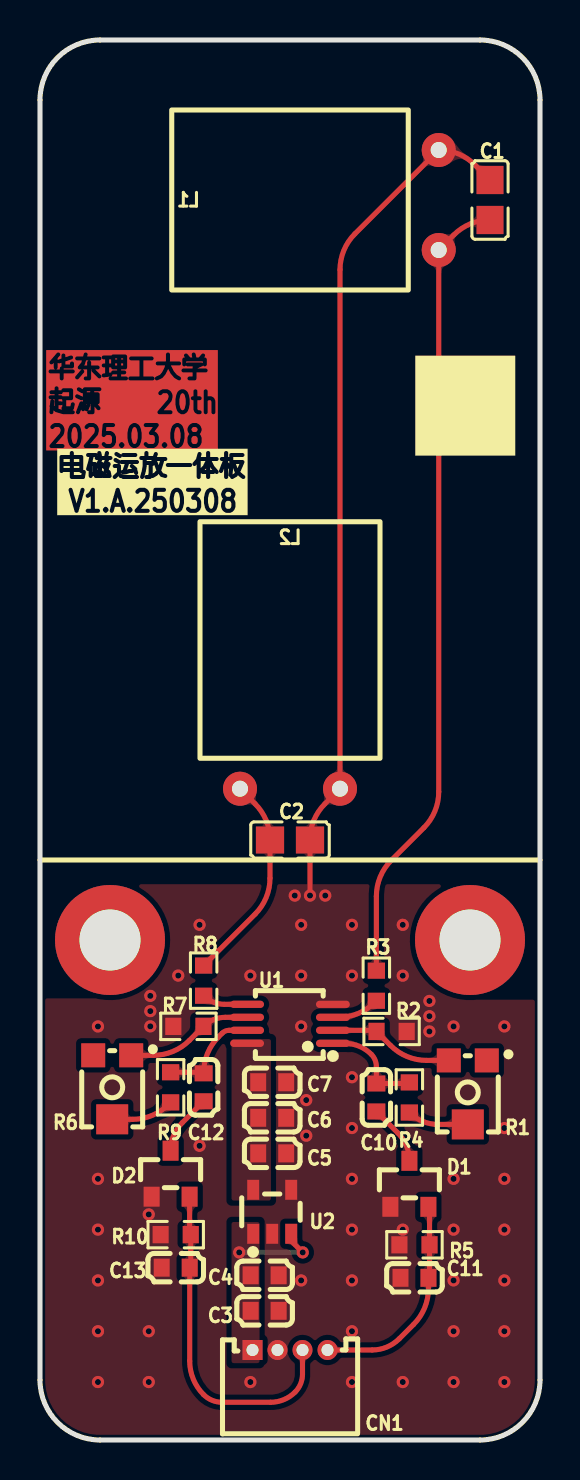
[diagram p3: board, top side]
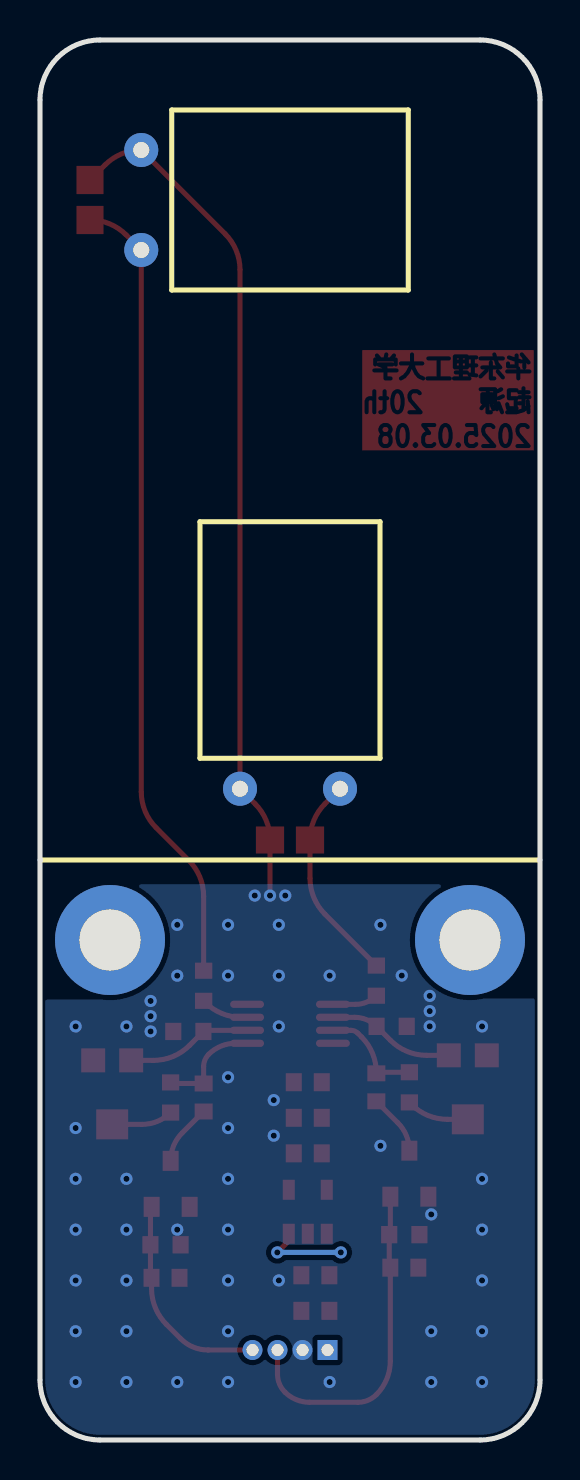
[diagram p4: board, bottom side, seen from below]

Outline 25 x 70 mm; copper layers: Top Layer, Bottom Layer. Coordinates in mm from the lower left corner of the outline.
Outline path: 0,67 0,3 arc(0.88,0.88) 3,0 22,0 arc(24.12,0.88) 25,3 25,67 arc(24.12,69.12) 22,70 3,70 arc(0.88,69.12) 0,67
Stack: Top Layer 0.035mm / Dielectric1 1.51mm FR4 er 4.5 / Bottom Layer 0.035mm

## Design rules (mm)
template: xyf_v1.1
spacing copperThickness1oz (default): track to track 0.102, other pairs 0.152 to 0.3
spacing copperThickness2oz: track to track 0.203, other pairs 0.152 to 0.3
spacing 0焊盘板框间距: track to track 0.152, other pairs 0 to 0.3
spacing copperThicknessInner0.5oz: track to track 0.089, other pairs 0.152 to 0.3
track width copperThickness1oz (default): min 0.127, default 0.254, max 2.54
track width copperThickness2oz: min 0.203, default 0.254, max 2.54
track width copperThickness0.5oz: min 0.089, default 0.254, max 2.54
differential pair differentialPair (default): width min 0.127, default 0.254, max 2.54; gap min 0.152, default 0.152
via viaSize (default): diameter min 0.5, default 0.61, max 10; hole min 0.3, default 0.305, max 6.3
via viaSize2: diameter min 0.5, default 0.61, max 10; hole min 0.3, default 0.305, max 6.299
via viaSize4: diameter min 0.45, default 0.61, max 10; hole min 0.3, default 0.305, max 6.299

## Placement (name value [footprint] x y rotation side)
C1  6.2nF  [C0805]  22.5 62 270 top
C2  6.2nF  [C0805]  12.5 30 0 top
C3  22uF  [C0603]  11.23 6.46 180 top
C4  100nF  [C0603]  11.23 8.24 180 top
C5  22uF  [C0603]  11.61 14.33 180 top
C6  22uF  [C0603]  11.61 16.11 180 top
C7  100nF  [C0603]  11.61 17.89 180 top
C10  100nF  [C0603]  16.82 17.13 90 top
C11  100nF  [C0603]  18.72 8.11 180 top
C12  100nF  [C0603]  8.18 17.63 90 top
C13  100nF  [C0603]  6.78 8.62 180 top
CN1  HC-1.25-4AW  [CONN-TH_4P-P1.25_HCTL_HC-1.25-4AW]  12.5 4.5 0 top
D1  BAT54SLT1G  [SOT-23_L2.9-W1.3-P1.90-LS2.4-BR]  18.47 12.81 270 top
D2  BAT54SLT1G  [SOT-23_L2.9-W1.3-P1.90-LS2.4-BR]  6.53 13.32 270 top
L1  10mH  [INDUCTOR-H]  12.5 62 180 bottom
L2  10mH  [INDUCTOR-H]  12.5 40 90 bottom
QR1  -  [JLC-QRCODE-5x5]  21.26 51.72 0 top
R1  100kΩ  [RES-ADJ-SMD_TC33X-2-104E]  21.39 17.38 180 top
R2  1kΩ  [R0603]  17.58 20.43 180 top
R3  1kΩ  [R0603]  16.82 22.71 270 top
R4  47kΩ  [R0603]  18.47 17.13 90 top
R5  47kΩ  [R0603]  18.72 9.76 0 top
R6  100kΩ  [RES-ADJ-SMD_TC33X-2-104E]  3.61 17.63 180 top
R7  1kΩ  [R0603]  7.42 20.68 0 top
R8  1kΩ  [R0603]  8.18 22.97 270 top
R9  47kΩ  [R0603]  6.53 17.63 90 top
R10  47kΩ  [R0603]  6.78 10.27 0 top
SCREW1  -  [M3螺丝]  3.5 25 0 top
SCREW2  -  [M3螺丝]  21.5 25 0 top
U1  RS822XM  [MSOP-8_L3.0-W3.0-P0.65-LS5.0-BL]  12.5 20.81 90 top
U2  TPS7A2042PDBVR  [SOT-23-5_L2.9-W1.6-P0.95-LS2.8-BR]  11.61 11.41 270 top

## Footprints (pads in the part's own frame, mm; a bottom-side part is the same pattern mirrored in y, then rotated)
C0603
  rect 0.8x0.9 smd: 1(-0.7,0) 2(0.7,0)
C0805
  rect 1.41x1.35 smd: 1(-1,0) 2(1,0)
CONN-TH_4P-P1.25_HCTL_HC-1.25-4AW
  rect 1x1 hole 0.6: 1(-1.875,0)
  round 1 hole 0.6: 2(-0.625,0) 3(0.625,0) 4(1.875,0)
INDUCTOR-H
  round 1.7 hole 0.8: 1(-7.437,2.5) 2(-7.437,-2.5)
M3螺丝
  round 5.5 hole 3.05: 1(0,0)
MSOP-8_L3.0-W3.0-P0.65-LS5.0-BL
  oval 0.364x1.692 smd: 1(-0.975,-2.146) 2(-0.325,-2.146) 3(0.325,-2.146) 4(0.975,-2.146) 5(0.975,2.146) 6(0.325,2.146) 7(-0.325,2.146) 8(-0.975,2.146)
R0603
  rect 0.806x0.864 smd: 1(-0.753,0) 2(0.753,0)
RES-ADJ-SMD_TC33X-2-104E
  rect 1.2x1.2 smd: 1(-0.95,-1.6) 3(0.95,-1.6)
  rect 1.6x1.5 smd: 2(0,1.6)
SOT-23-5_L2.9-W1.6-P0.95-LS2.8-BR
  rect 1x0.6 smd: 1(1.1,-0.95) 2(1.1,0) 3(1.1,0.95) 4(-1.1,0.95) 5(-1.1,-0.95)
SOT-23_L2.9-W1.3-P1.90-LS2.4-BR
  rect 1x0.8 smd: 1(1.15,-0.95) 2(1.15,0.95) 3(-1.15,0)

## Nets
As in the schematic.

Pads without a net: R1 1; R6 3; SCREW1 1; SCREW2 1

## Via types
v1: diameter 0.61, hole 0.305, Top Layer to Bottom Layer, 57 vias

## Routing (per net, layer and track width the routed paths; a pad name or vN(x,y) marks a point on that pad's centre or on a via; arc(x,y) is an arc through that point)
+5V: length 4.3
  Top Layer w0.254: v1(13.13,9.38) 12.56,9.95 U2.3
  Bottom Layer w0.254: v1(9.96,9.38) v1(13.13,9.38)
GND: length 42.8
  Top Layer w0.254: v1(13.5,27.22) C2.2 13.5,30.01 arc(13.69,30.98) 14.24,31.81 L2.1 15,58.51 arc(15.19,59.48) 15.74,60.31 L1.1 19.95,64.5 arc(20.92,64.31) 21.74,63.76 C1.1
  vias: v1(2.9,20.68) v1(2.9,13.06) v1(2.9,10.52) v1(2.9,7.98) v1(2.9,5.44) v1(2.9,2.9) v1(5.44,11.28) v1(5.44,5.44) v1(5.44,2.9) v1(5.51,22.21) v1(5.51,21.44) v1(5.51,20.68) v1(6.91,23.22) v1(7.98,25.76) v1(7.98,14.71) v1(10.52,23.22) v1(10.52,2.9) v1(12.74,27.22) v1(13.06,25.76) v1(13.06,23.22) v1(13.06,20.68) v1(13.06,7.98) v1(13.31,17) v1(13.31,15.22) v1(14.26,27.22) v1(15.6,25.76) v1(15.6,23.22) v1(15.6,18.14) v1(15.6,15.6) v1(15.6,13.06) v1(15.6,10.52) v1(15.6,7.98) v1(15.6,5.44) v1(15.6,2.9) v1(18.14,25.76) v1(18.14,23.22) v1(18.14,10.52) v1(18.14,2.9) v1(19.47,21.95) v1(19.47,21.19) v1(19.47,20.43) v1(20.68,20.68) v1(20.68,13.06) v1(20.68,10.52) v1(20.68,7.98) v1(20.68,5.44) v1(20.68,2.9) v1(23.22,20.68) v1(23.22,15.6) v1(23.22,13.06) v1(23.22,10.52) v1(23.22,7.98) v1(23.22,5.44) v1(23.22,2.9)
L1: length 40.2
  Top Layer w0.254: C1.2 22.49,61 arc(21.52,60.81) 20.69,60.26 L1.2 19.94,32.41 arc(19.74,31.44) 19.19,30.61 17.56,28.98 arc(17.01,28.16) 16.82,27.19 R3.1
L2: length 10.6
  Top Layer w0.254: L2.2 10.76,31.81 arc(11.31,30.98) 11.5,30.01 C2.1 11.5,28.09 arc(11.31,27.12) 10.76,26.3 R8.1
OUT1: length 10.9
  Top Layer w0.254: CN1.4 16.61,4.5 arc(17.34,4.65) 17.96,5.06 18.68,5.78 arc(19.23,6.6) 19.42,7.57 C11.1 arc(19.46,8.17) 19.48,8.24 R5.2 19.48,11.52 arc(19.46,11.59) 19.42,11.66
OUT2: length 17.1
  Top Layer w0.254: D2.2 7.48,10.41 arc(7.5,10.33) R10.2 7.54,8.75 arc(7.52,8.68) C13.1 7.49,3.95 arc(7.67,3.04) 8.18,2.27 arc(8.6,1.98) 9.1,1.89 11.53,1.89 arc(12.19,2.02) 12.75,2.39 arc(13.03,2.81) 13.12,3.29 CN1.3
$1N2795: length 6.3
  Top Layer w0.254: U1.2 16.69,20.48 arc(16.76,20.47) R2.2 17.53,19.72 arc(18.35,19.17) 19.33,18.98 R1.3
$1N2799: length 2.4
  Top Layer w0.254: R3.2 16.74,21.88 arc(15.91,21.33) 14.94,21.13 U1.3
$1N2904: length 3.1
  Top Layer w0.254: R1.2 19.9,15.78 arc(19.13,15.93) R4.1
$1N2908: length 5.3
  Top Layer w0.254: U1.1 15.24,19.83 arc(15.96,19.69) 16.56,19.28 arc(16.75,19) 16.82,18.67 C10.2 18.34,17.83 arc(18.41,17.84) R4.2
$1N3029: length 3.1
  Top Layer w0.254: C10.1 17.89,15.35 arc(18.32,14.71) D1.3
$1N3708: length 6.4
  Top Layer w0.254: U1.6 9.26,21.13 arc(8.67,21.02) R7.2 7.47,19.98 arc(6.65,19.43) 5.67,19.23 R6.1
$1N3712: length 2.3
  Top Layer w0.254: U1.5 9.22,21.78 arc(8.66,21.9) R8.2
$1N3714: length 3.2
  Top Layer w0.254: R9.1 6.43,16.78 arc(5.6,16.23) 4.63,16.03 R6.2
$1N3716: length 5.2
  Top Layer w0.254: R9.2 8.05,18.39 arc(8.12,18.37) C12.2 8.18,18.36 arc(8.38,19.33) 8.93,20.16 9.11,20.34 arc(9.27,20.45) 9.45,20.48 U1.7
$1N3721: length 3.1
  Top Layer w0.254: C12.1 7.11,15.86 arc(6.68,15.22) D2.3

## Copper pours and planes (outline as drawn; the poured copper is in the pictures)
4V2 on Top Layer: 9.58,20.05 11.55,20.05 11.55,11.97 9.58,11.97
+5V on Top Layer: 9.58,10.9 10.98,10.9 10.98,3.84 9.58,3.84
GND on Top Layer: -1.98,27.79 27.87,27.79 27.87,-2.31 -1.98,-2.31
GND on Bottom Layer: -1.98,27.79 27.87,27.79 27.87,-2.31 -1.98,-2.31

Small or netless copper shapes (teardrops, artwork), in the pictures only: 58 on Top Layer, 2 on Bottom Layer

## Text on the board
Top Layer: 华东理工大学 / 起源    20th / 2025.03.08
Top Silkscreen Layer: 电磁运放一体板 / V1.A.250308

# Board 双电感A型V2
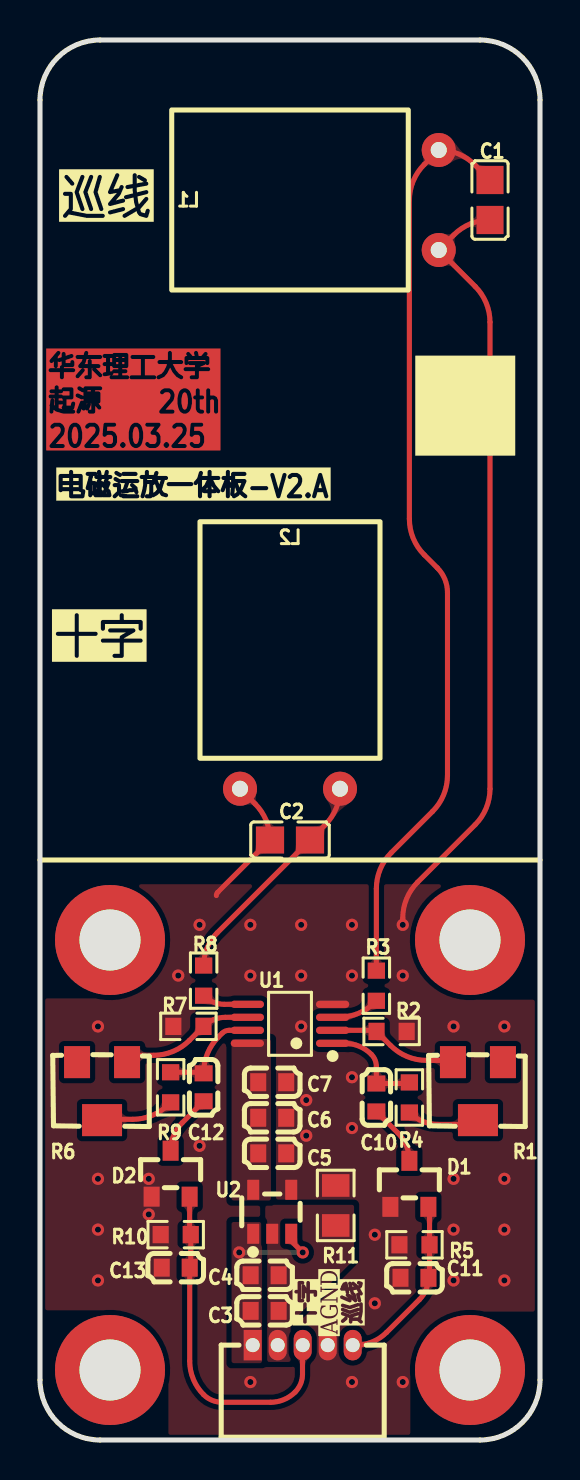
[diagram p5: board, top side]
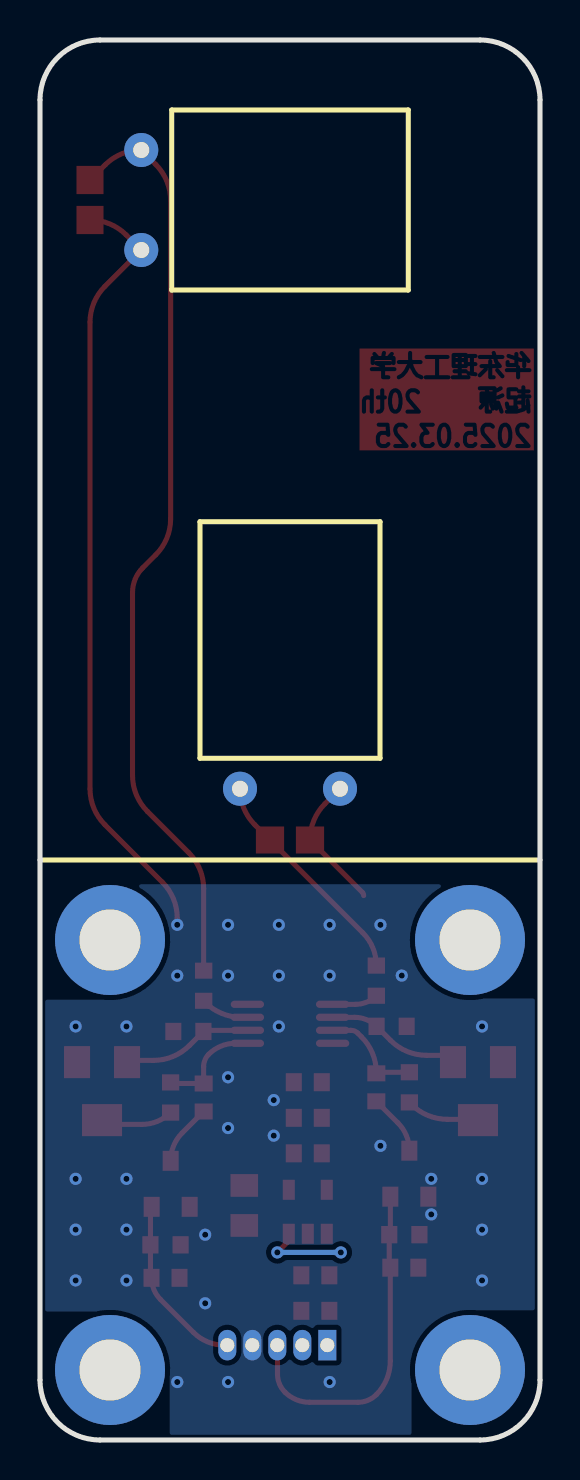
[diagram p6: board, bottom side, seen from below]

Outline 25 x 70 mm; copper layers: Top Layer, Bottom Layer. Coordinates in mm from the lower left corner of the outline.
Outline path: 0,67 0,3 arc(0.88,0.88) 3,0 22,0 arc(24.12,0.88) 25,3 25,67 arc(24.12,69.12) 22,70 3,70 arc(0.88,69.12) 0,67
Stack: Top Layer 0.035mm / Dielectric1 1.51mm FR4 er 4.5 / Bottom Layer 0.035mm

## Design rules (mm)
template: xyf_v1.1
spacing copperThickness1oz (default): track to track 0.102, other pairs 0.152 to 0.3
spacing copperThickness2oz: track to track 0.203, other pairs 0.152 to 0.3
spacing 0焊盘板框间距: track to track 0.152, other pairs 0 to 0.3
spacing copperThicknessInner0.5oz: track to track 0.089, other pairs 0.152 to 0.3
track width copperThickness1oz (default): min 0.127, default 0.254, max 2.54
track width copperThickness2oz: min 0.203, default 0.254, max 2.54
track width copperThickness0.5oz: min 0.089, default 0.254, max 2.54
differential pair differentialPair (default): width min 0.127, default 0.254, max 2.54; gap min 0.152, default 0.152
via viaSize (default): diameter min 0.5, default 0.61, max 10; hole min 0.3, default 0.305, max 6.3
via viaSize2: diameter min 0.5, default 0.61, max 10; hole min 0.3, default 0.305, max 6.299
via viaSize4: diameter min 0.45, default 0.61, max 10; hole min 0.3, default 0.305, max 6.299

## Placement (name value [footprint] x y rotation side)
C1  6.2nF  [C0805]  22.5 62 270 top
C2  6.2nF  [C0805]  12.5 30 0 top
C3  22uF  [C0603]  11.23 6.46 180 top
C4  100nF  [C0603]  11.23 8.24 180 top
C5  22uF  [C0603]  11.61 14.33 180 top
C6  22uF  [C0603]  11.61 16.11 180 top
C7  100nF  [C0603]  11.61 17.89 180 top
C10  100nF  [C0603]  16.82 17.13 90 top
C11  100nF  [C0603]  18.72 8.11 180 top
C12  100nF  [C0603]  8.18 17.63 90 top
C13  100nF  [C0603]  6.78 8.62 180 top
CN1  BX-MX1.25-5PWZ  [CONN-TH_5P-P1.25_BX-MX1.25-5PWZ]  13.13 4.74 0 top
D1  BAT54SLT1G  [SOT-23_L2.9-W1.3-P1.90-LS2.4-BR]  18.47 12.81 270 top
D2  BAT54SLT1G  [SOT-23_L2.9-W1.3-P1.90-LS2.4-BR]  6.53 13.32 270 top
L1  10mH  [INDUCTOR-H]  12.5 62 180 bottom
L2  10mH  [INDUCTOR-H]  12.5 40 90 bottom
QR1  -  [JLC-QRCODE-5x5]  21.26 51.72 0 top
R1  50kΩ  [RES-ADJ-SMD_3224W]  21.9 17.44 180 top
R2  1kΩ  [R0603]  17.58 20.43 180 top
R3  5.1kΩ  [R0603]  16.82 22.71 270 top
R4  5.1kΩ  [R0603]  18.47 17.13 90 top
R5  47kΩ  [R0603]  18.72 9.76 0 top
R6  50kΩ  [RES-ADJ-SMD_3224W]  3.1 17.44 180 top
R7  1kΩ  [R0603]  7.42 20.68 0 top
R8  5.1kΩ  [R0603]  8.18 22.97 270 top
R9  5.1kΩ  [R0603]  6.53 17.63 90 top
R10  47kΩ  [R0603]  6.78 10.27 0 top
R11  0Ω  [R0805]  14.79 11.73 90 top
SCREW1  -  [M3螺丝]  3.5 25 0 top
SCREW2  -  [M3螺丝]  21.5 25 0 top
SCREW3  -  [M3螺丝]  21.5 3.5 0 top
SCREW4  -  [M3螺丝]  3.5 3.5 0 top
U1  OPA2350EA/2K5  [VSSOP-8_L3.0-W3.0-P0.65-LS5.0-BL]  12.5 20.81 90 top
U2  TPS7A2042PDBVR  [SOT-23-5_L2.9-W1.6-P0.95-LS2.8-BR]  11.61 11.41 270 top

## Footprints (pads in the part's own frame, mm; a bottom-side part is the same pattern mirrored in y, then rotated)
C0603
  rect 0.8x0.9 smd: 1(-0.7,0) 2(0.7,0)
C0805
  rect 1.41x1.35 smd: 1(-1,0) 2(1,0)
CONN-TH_5P-P1.25_BX-MX1.25-5PWZ
  rect 0.9x1.524 hole 0.7: 1(-2.5,0)
  oval 0.9x1.524 hole 0.7: 2(-1.25,0) 3(0,0) 4(1.25,0) 5(2.5,0)
INDUCTOR-H
  round 1.7 hole 0.8: 1(-7.437,2.5) 2(-7.437,-2.5)
M3螺丝
  round 5.5 hole 3.05: 1(0,0)
R0603
  rect 0.806x0.864 smd: 1(-0.753,0) 2(0.753,0)
R0805
  rect 1.133x1.377 smd: 1(-1,0) 2(1,0)
RES-ADJ-SMD_3224W
  rect 1.3x1.6 smd: 1(-1.25,-1.45) 3(1.25,-1.45)
  rect 2x1.6 smd: 2(0,1.45)
SOT-23-5_L2.9-W1.6-P0.95-LS2.8-BR
  rect 1x0.6 smd: 1(1.1,-0.95) 2(1.1,0) 3(1.1,0.95) 4(-1.1,0.95) 5(-1.1,-0.95)
SOT-23_L2.9-W1.3-P1.90-LS2.4-BR
  rect 1x0.8 smd: 1(1.15,-0.95) 2(1.15,0.95) 3(-1.15,0)
VSSOP-8_L3.0-W3.0-P0.65-LS5.0-BL
  oval 0.364x1.662 smd: 1(-0.975,-2.131) 2(-0.325,-2.131) 3(0.325,-2.131) 4(0.975,-2.131) 5(0.975,2.131) 6(0.325,2.131) 7(-0.325,2.131) 8(-0.975,2.131)

## Nets
As in the schematic.

Pads without a net: R1 1; R6 3; SCREW1 1; SCREW2 1; SCREW3 1; SCREW4 1

## Via types
v1: diameter 0.61, hole 0.305, Top Layer to Bottom Layer, 37 vias

## Routing (per net, layer and track width the routed paths; a pad name or vN(x,y) marks a point on that pad's centre or on a via; arc(x,y) is an arc through that point)
+5V: length 4.3
  Top Layer w0.254: U2.3 12.56,9.95 v1(13.13,9.38)
  Bottom Layer w0.254: v1(9.96,9.38) v1(13.13,9.38)
AGND: length 46.3
  Top Layer w0.254: v1(18.14,25.76) 18.14,26.09 arc(18.33,27.06) 18.88,27.89 21.76,30.76 arc(22.31,31.59) 22.5,32.56 22.5,55.89 arc(22.31,56.86) 21.76,57.68 L1.2 20.69,60.26 arc(21.52,60.81) 22.49,61 C1.2 ; L2.2 10.76,31.81 arc(11.31,30.98) 11.5,30.01 C2.1 8.88,27.38 arc(8.83,27.31) 8.82,27.22
  vias: v1(2.9,20.68) v1(2.9,13.06) v1(2.9,10.52) v1(2.9,7.98) v1(5.44,13.06) v1(5.44,11.28) v1(6.91,23.22) v1(7.98,25.76) v1(7.98,14.71) v1(10.52,25.76) v1(10.52,23.22) v1(10.52,2.9) v1(13.06,25.76) v1(13.06,23.22) v1(13.06,20.68) v1(13.31,17) v1(13.31,15.22) v1(15.6,25.76) v1(15.6,23.22) v1(15.6,18.14) v1(15.6,15.6) v1(15.6,2.9) v1(16.74,10.26) v1(16.74,6.84) v1(18.14,23.22) v1(18.14,2.9) v1(20.68,20.68) v1(20.68,13.06) v1(20.68,10.52) v1(20.68,7.98) v1(23.22,20.68) v1(23.22,13.06) v1(23.22,10.52) v1(23.22,7.98)
L1: length 46.5
  Top Layer w0.254: C1.1 21.74,63.76 arc(20.92,64.31) 19.95,64.5 L1.1 19.21,63.78 arc(18.66,62.95) 18.47,61.98 18.47,46.05 arc(18.66,45.08) 19.21,44.26 19.87,43.61 arc(20.24,43.04) 20.37,42.38 20.37,33.23 arc(20.18,32.25) 19.63,31.43 17.56,29.36 arc(17.01,28.54) 16.82,27.57 R3.1
L2: length 11.5
  Top Layer w0.254: L2.1 15,32.55 arc(14.81,31.58) 14.26,30.76 C2.2 8.86,25.36 arc(8.36,24.61) R8.1
OUT1: length 9
  Top Layer w0.254: CN1.5 15.79,4.74 arc(16.62,4.91) 17.33,5.38 18.97,7.03 arc(19.31,7.52) C11.1 arc(19.46,8.17) 19.48,8.24 R5.2 19.48,11.52 arc(19.46,11.59) 19.42,11.66
OUT2: length 17.1
  Top Layer w0.254: 13.12,4.5 13.12,3.29 arc(13.03,2.81) 12.75,2.39 arc(12.19,2.02) 11.53,1.89 9.1,1.89 arc(8.6,1.98) 8.18,2.27 arc(7.67,3.04) 7.49,3.95 C13.1 arc(7.52,8.68) 7.54,8.75 R10.2 arc(7.5,10.33) 7.48,10.41 D2.2
$1N2795: length 6.3
  Top Layer w0.254: 14.65,20.48 16.69,20.48 arc(16.76,20.47) R2.2 17.53,19.72 arc(18.35,19.17) 19.33,18.98 20.44,18.98
$1N2799: length 2.4
  Top Layer w0.254: R3.2 16.74,21.88 arc(15.91,21.33) 14.94,21.13 14.65,21.13
$1N2908: length 5.3
  Top Layer w0.254: 14.65,19.83 15.24,19.83 arc(15.96,19.69) 16.56,19.28 arc(16.75,19) 16.82,18.67 C10.2 18.34,17.83 arc(18.41,17.84) R4.2
$1N3029: length 3.1
  Top Layer w0.254: C10.1 17.89,15.35 arc(18.32,14.71) D1.3
$1N3708: length 6.4
  Top Layer w0.254: 4.56,19.23 5.67,19.23 arc(6.65,19.43) 7.47,19.98 R7.2 arc(8.67,21.02) 9.26,21.13 10.35,21.13
$1N3712: length 2.3
  Top Layer w0.254: 10.35,21.78 9.22,21.78 arc(8.66,21.9) R8.2
$1N3716: length 5.2
  Top Layer w0.254: R9.2 8.05,18.39 arc(8.12,18.37) C12.2 8.18,18.36 arc(8.38,19.33) 8.93,20.16 9.11,20.34 arc(9.27,20.45) 9.45,20.48 10.35,20.48
$1N3721: length 3.1
  Top Layer w0.254: C12.1 7.11,15.86 arc(6.68,15.22) D2.3
$1N7358: length 3.1
  Top Layer w0.254: 21.39,15.78 19.9,15.78 arc(19.13,15.93) R4.1
$1N7360: length 3.2
  Top Layer w0.254: R9.1 6.43,16.78 arc(5.6,16.23) 4.63,16.03 3.61,16.03

## Copper pours and planes (outline as drawn; the poured copper is in the pictures)
4V2 on Top Layer: 9.58,20.05 11.55,20.05 11.55,11.97 9.58,11.97
+5V on Top Layer: 9.58,10.9 11.1,10.9 11.1,3.84 9.58,3.84
AGND on Top Layer: -1.98,27.79 27.87,27.79 27.87,-2.31 -1.98,-2.31
AGND on Bottom Layer: -1.98,27.79 27.87,27.79 27.87,-2.31 -1.98,-2.31
GND on Top Layer: 15.7,11.76 15.7,9.01 12.53,5.84 12.53,3.9 11.26,3.9 11.26,11.76

Small or netless copper shapes (teardrops, artwork), in the pictures only: 57 on Top Layer, 2 on Bottom Layer

## Text on the board
Top Layer: 华东理工大学 / 起源    20th / 2025.03.25
Top Silkscreen Layer: 十字 | AGND | 巡线 | 电磁运放一体板-V2.A

# Board 双电感A型V2_1
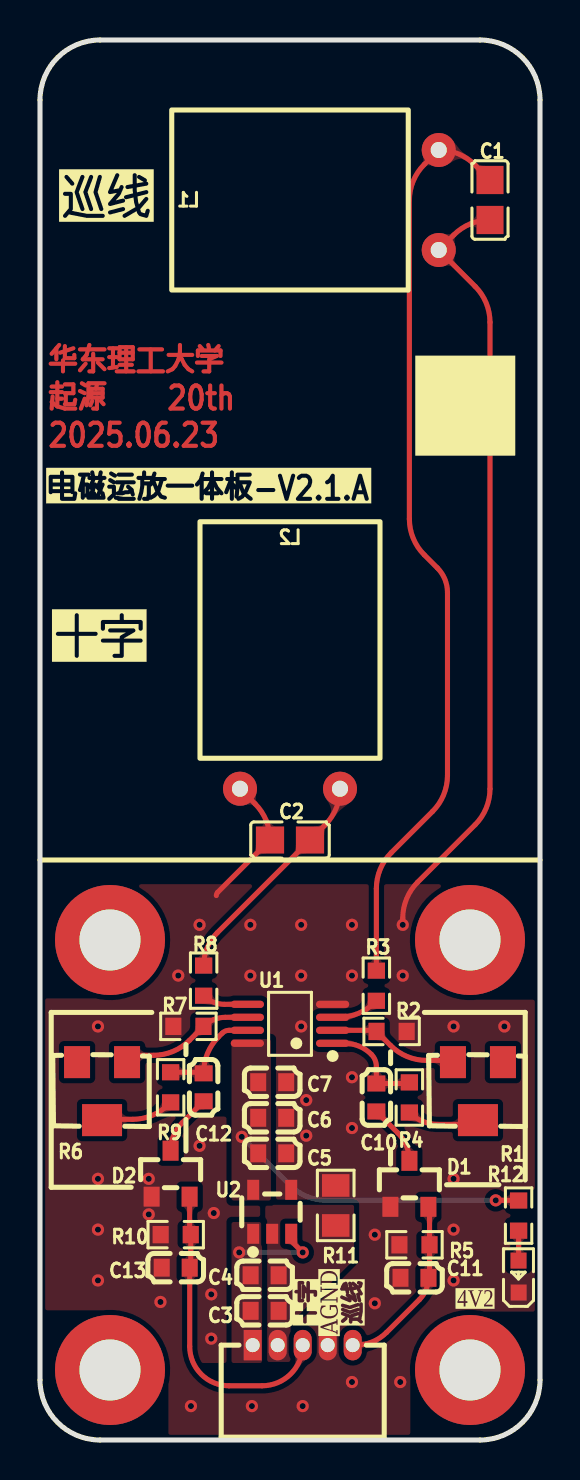
[diagram p7: board, top side]
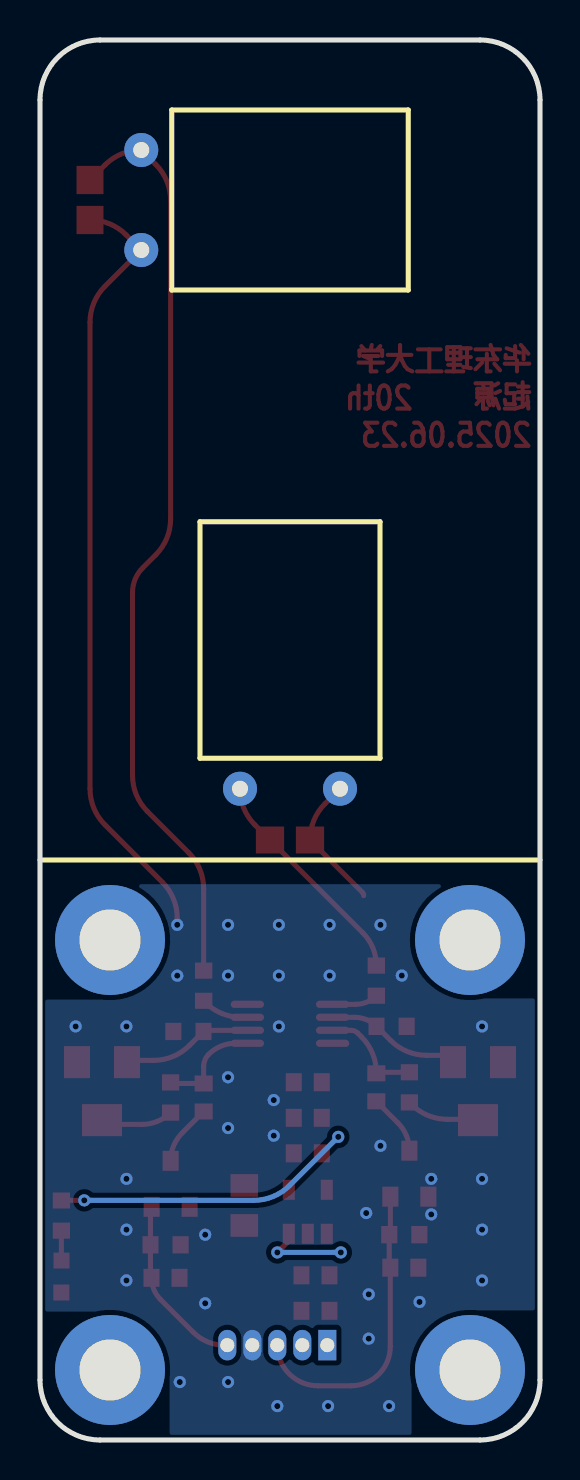
[diagram p8: board, bottom side, seen from below]

Outline 25 x 70 mm; copper layers: Top Layer, Bottom Layer. Coordinates in mm from the lower left corner of the outline.
Outline path: 0,67 0,3 arc(0.88,0.88) 3,0 22,0 arc(24.12,0.88) 25,3 25,67 arc(24.12,69.12) 22,70 3,70 arc(0.88,69.12) 0,67
Stack: Top Layer 0.035mm / Dielectric1 1.51mm FR4 er 4.5 / Bottom Layer 0.035mm

## Design rules (mm)
template: xyf_v1.1
spacing copperThickness1oz (default): track to track 0.102, other pairs 0.152 to 0.3
spacing copperThickness2oz: track to track 0.203, other pairs 0.152 to 0.3
spacing 0焊盘板框间距: track to track 0.152, other pairs 0 to 0.3
spacing copperThicknessInner0.5oz: track to track 0.089, other pairs 0.152 to 0.3
track width copperThickness1oz (default): min 0.127, default 0.254, max 2.54
track width copperThickness2oz: min 0.203, default 0.254, max 2.54
track width copperThickness0.5oz: min 0.089, default 0.254, max 2.54
differential pair differentialPair (default): width min 0.127, default 0.254, max 2.54; gap min 0.152, default 0.152
via viaSize (default): diameter min 0.5, default 0.61, max 10; hole min 0.3, default 0.305, max 6.3
via viaSize2: diameter min 0.5, default 0.61, max 10; hole min 0.3, default 0.305, max 6.299
via viaSize4: diameter min 0.45, default 0.61, max 10; hole min 0.3, default 0.305, max 6.299

## Placement (name value [footprint] x y rotation side)
C1  6.2nF  [C0805]  22.5 62 270 top
C2  6.2nF  [C0805]  12.5 30 0 top
C3  22uF  [C0603]  11.23 6.46 180 top
C4  100nF  [C0603]  11.23 8.24 180 top
C5  22uF  [C0603]  11.61 14.33 180 top
C6  22uF  [C0603]  11.61 16.11 180 top
C7  100nF  [C0603]  11.61 17.89 180 top
C10  100nF  [C0603]  16.82 17.13 90 top
C11  100nF  [C0603]  18.72 8.11 180 top
C12  100nF  [C0603]  8.18 17.63 90 top
C13  100nF  [C0603]  6.78 8.62 180 top
CN1  BX-MX1.25-5PWZ  [CONN-TH_5P-P1.25_BX-MX1.25-5PWZ]  13.13 4.74 0 top
D1  BAT54SLT1G  [SOT-23_L2.9-W1.3-P1.90-LS2.4-BR]  18.47 12.81 270 top
D2  BAT54SLT1G  [SOT-23_L2.9-W1.3-P1.90-LS2.4-BR]  6.53 13.32 270 top
L1  10mH  [INDUCTOR-H]  12.5 62 180 bottom
L2  10mH  [INDUCTOR-H]  12.5 40 90 bottom
LED1  XL-1608UBC-04  [LED0603-RD_BLUE]  23.93 8.17 90 top
QR1  -  [JLC-QRCODE-5x5]  21.26 51.72 0 top
R1  50kΩ  [RES-ADJ-SMD_3224W]  21.9 17.44 180 top
R2  1kΩ  [R0603]  17.58 20.43 180 top
R3  5.1kΩ  [R0603]  16.82 22.71 270 top
R4  5.1kΩ  [R0603]  18.47 17.13 90 top
R5  47kΩ  [R0603]  18.72 9.76 0 top
R6  50kΩ  [RES-ADJ-SMD_3224W]  3.1 17.44 180 top
R7  1kΩ  [R0603]  7.42 20.68 0 top
R8  5.1kΩ  [R0603]  8.18 22.97 270 top
R9  5.1kΩ  [R0603]  6.53 17.63 90 top
R10  47kΩ  [R0603]  6.78 10.27 0 top
R11  0Ω  [R0805]  14.79 11.73 90 top
R12  5.1kΩ  [R0603]  23.93 11.22 90 top
SCREW1  -  [M3螺丝]  3.5 25 0 top
SCREW2  -  [M3螺丝]  21.5 25 0 top
SCREW3  -  [M3螺丝]  21.5 3.5 0 top
SCREW4  -  [M3螺丝]  3.5 3.5 0 top
U1  OPA2350EA/2K5  [VSSOP-8_L3.0-W3.0-P0.65-LS5.0-BL]  12.5 20.81 90 top
U2  TPS7A2042PDBVR  [SOT-23-5_L2.9-W1.6-P0.95-LS2.8-BR]  11.61 11.41 270 top

## Footprints (pads in the part's own frame, mm; a bottom-side part is the same pattern mirrored in y, then rotated)
C0603
  rect 0.8x0.9 smd: 1(-0.7,0) 2(0.7,0)
C0805
  rect 1.41x1.35 smd: 1(-1,0) 2(1,0)
CONN-TH_5P-P1.25_BX-MX1.25-5PWZ
  rect 0.9x1.524 hole 0.7: 1(-2.5,0)
  oval 0.9x1.524 hole 0.7: 2(-1.25,0) 3(0,0) 4(1.25,0) 5(2.5,0)
INDUCTOR-H
  round 1.7 hole 0.8: 1(-7.437,2.5) 2(-7.437,-2.5)
LED0603-RD_BLUE
  rect 0.8x0.8 smd: 1(-0.799,-0.004) 2(0.799,0.004)
M3螺丝
  round 5.5 hole 3.05: 1(0,0)
R0603
  rect 0.806x0.864 smd: 1(-0.753,0) 2(0.753,0)
R0805
  rect 1.133x1.377 smd: 1(-1,0) 2(1,0)
RES-ADJ-SMD_3224W
  rect 1.3x1.6 smd: 1(-1.25,-1.45) 3(1.25,-1.45)
  rect 2x1.6 smd: 2(0,1.45)
SOT-23-5_L2.9-W1.6-P0.95-LS2.8-BR
  rect 1x0.6 smd: 1(1.1,-0.95) 2(1.1,0) 3(1.1,0.95) 4(-1.1,0.95) 5(-1.1,-0.95)
SOT-23_L2.9-W1.3-P1.90-LS2.4-BR
  rect 1x0.8 smd: 1(1.15,-0.95) 2(1.15,0.95) 3(-1.15,0)
VSSOP-8_L3.0-W3.0-P0.65-LS5.0-BL
  oval 0.364x1.662 smd: 1(-0.975,-2.131) 2(-0.325,-2.131) 3(0.325,-2.131) 4(0.975,-2.131) 5(0.975,2.131) 6(0.325,2.131) 7(-0.325,2.131) 8(-0.975,2.131)

## Nets
As in the schematic.

Pads without a net: R1 1; R6 3; SCREW1 1; SCREW2 1; SCREW3 1; SCREW4 1

## Via types
v1: diameter 0.61, hole 0.305, Top Layer to Bottom Layer, 42 vias

## Routing (per net, layer and track width the routed paths; a pad name or vN(x,y) marks a point on that pad's centre or on a via; arc(x,y) is an arc through that point)
4V2: length 15.1
  Top Layer w0.254: v1(22.79,11.98) 23.91,11.98 arc(23.92,11.98) R12.2
  Bottom Layer w0.254: v1(22.79,11.98) 14.31,11.98 arc(13.34,12.18) 12.52,12.73 v1(10.09,15.16)
+5V: length 4.3
  Top Layer w0.254: v1(13.13,9.38) 12.56,9.95 U2.3
  Bottom Layer w0.254: v1(9.96,9.38) v1(13.13,9.38)
AGND: length 46.3
  Top Layer w0.254: L2.2 10.76,31.81 arc(11.31,30.98) 11.5,30.01 C2.1 8.88,27.38 arc(8.83,27.31) 8.82,27.22 ; v1(18.14,25.76) 18.14,26.09 arc(18.33,27.06) 18.88,27.89 21.76,30.76 arc(22.31,31.59) 22.5,32.56 22.5,55.89 arc(22.31,56.86) 21.76,57.68 L1.2 20.69,60.26 arc(21.52,60.81) 22.49,61 C1.2
  vias: v1(2.9,20.68) v1(2.9,13.06) v1(2.9,10.52) v1(2.9,7.98) v1(5.44,13.06) v1(5.44,11.28) v1(6.02,6.9) v1(6.91,23.22) v1(7.55,1.69) v1(7.98,25.76) v1(7.98,14.71) v1(8.56,7.28) v1(8.56,5.07) v1(8.69,11.35) v1(10.52,25.76) v1(10.52,23.22) v1(10.59,1.69) v1(13.06,25.76) v1(13.06,23.22) v1(13.06,20.68) v1(13.13,1.69) v1(13.31,17) v1(13.31,15.22) v1(15.6,25.76) v1(15.6,23.22) v1(15.6,18.14) v1(15.6,15.6) v1(15.6,2.9) v1(16.74,10.26) v1(16.74,6.84) v1(18.01,2.9) v1(18.14,23.22) v1(20.68,20.68) v1(20.68,13.06) v1(20.68,10.52) v1(20.68,7.98) v1(23.22,20.68)
L1: length 46.5
  Top Layer w0.254: C1.1 21.74,63.76 arc(20.92,64.31) 19.95,64.5 L1.1 19.21,63.78 arc(18.66,62.95) 18.47,61.98 18.47,46.05 arc(18.66,45.08) 19.21,44.26 19.87,43.61 arc(20.24,43.04) 20.37,42.38 20.37,33.23 arc(20.18,32.25) 19.63,31.43 17.56,29.36 arc(17.01,28.54) 16.82,27.57 R3.1
L2: length 11.5
  Top Layer w0.254: L2.1 15,32.55 arc(14.81,31.58) 14.26,30.76 C2.2 8.86,25.36 arc(8.36,24.61) R8.1
OUT1: length 9
  Top Layer w0.254: CN1.5 15.79,4.74 arc(16.62,4.91) 17.33,5.38 18.97,7.03 arc(19.31,7.52) C11.1 arc(19.46,8.17) 19.48,8.24 R5.2 19.48,11.52 arc(19.46,11.59) 19.42,11.66
OUT2: length 15.5
  Top Layer w0.254: D2.2 7.48,10.41 arc(7.5,10.33) R10.2 7.54,8.75 arc(7.52,8.68) C13.1 7.49,4.68 arc(8.06,3.29) 9.45,2.71 11.1,2.71 arc(12.54,3.31) CN1.3
$1N2795: length 6.3
  Top Layer w0.254: 20.44,18.98 19.33,18.98 arc(18.35,19.17) 17.53,19.72 R2.2 arc(16.76,20.47) 16.69,20.48 14.65,20.48
$1N2799: length 2.4
  Top Layer w0.254: 14.65,21.13 14.94,21.13 arc(15.91,21.33) 16.74,21.88 R3.2
$1N2908: length 5.3
  Top Layer w0.254: 14.65,19.83 15.24,19.83 arc(15.96,19.69) 16.56,19.28 arc(16.75,19) 16.82,18.67 C10.2 18.34,17.83 arc(18.41,17.84) R4.2
$1N3029: length 3.1
  Top Layer w0.254: C10.1 17.89,15.35 arc(18.32,14.71) D1.3
$1N3708: length 6.4
  Top Layer w0.254: 4.56,19.23 5.67,19.23 arc(6.65,19.43) 7.47,19.98 R7.2 arc(8.67,21.02) 9.26,21.13 10.35,21.13
$1N3712: length 2.3
  Top Layer w0.254: 10.35,21.78 9.22,21.78 arc(8.66,21.9) R8.2
$1N3716: length 5.2
  Top Layer w0.254: R9.2 8.05,18.39 arc(8.12,18.37) C12.2 8.18,18.36 arc(8.38,19.33) 8.93,20.16 9.11,20.34 arc(9.27,20.45) 9.45,20.48 10.35,20.48
$1N3721: length 3.1
  Top Layer w0.254: C12.1 7.11,15.86 arc(6.68,15.22) D2.3
$1N7358: length 3.1
  Top Layer w0.254: 21.39,15.78 19.9,15.78 arc(19.13,15.93) R4.1
$1N7360: length 3.2
  Top Layer w0.254: 3.61,16.03 4.63,16.03 arc(5.6,16.23) 6.43,16.78 R9.1
$1N13241: length 1.5
  Top Layer w0.254: R12.1 23.93,8.98 arc(23.93,8.98) LED1.2

## Copper pours and planes (outline as drawn; the poured copper is in the pictures)
4V2 on Top Layer: 9.58,20.05 11.55,20.05 11.55,11.97 9.58,11.97
+5V on Top Layer: 9.58,10.9 11.1,10.9 11.1,3.84 9.58,3.84
AGND on Top Layer: -1.98,27.79 27.87,27.79 27.87,-2.31 -1.98,-2.31
AGND on Bottom Layer: -1.98,27.79 27.87,27.79 27.87,-2.31 -1.98,-2.31
GND on Top Layer: 15.7,11.76 15.7,9.01 12.53,5.84 12.53,3.9 11.26,3.9 11.26,11.76

Small or netless copper shapes (teardrops, artwork), in the pictures only: 61 on Top Layer, 4 on Bottom Layer

## Text on the board
Top Layer: 华东理工大学 / 起源    20th / 2025.06.23
Top Silkscreen Layer: 4V2 | 十字 | AGND | 巡线 | 电磁运放一体板-V2.1.A
